# EAGLE schematic EasyBMS_Panel (EAGLE 9.6.2)

## Sheet 1 of 2
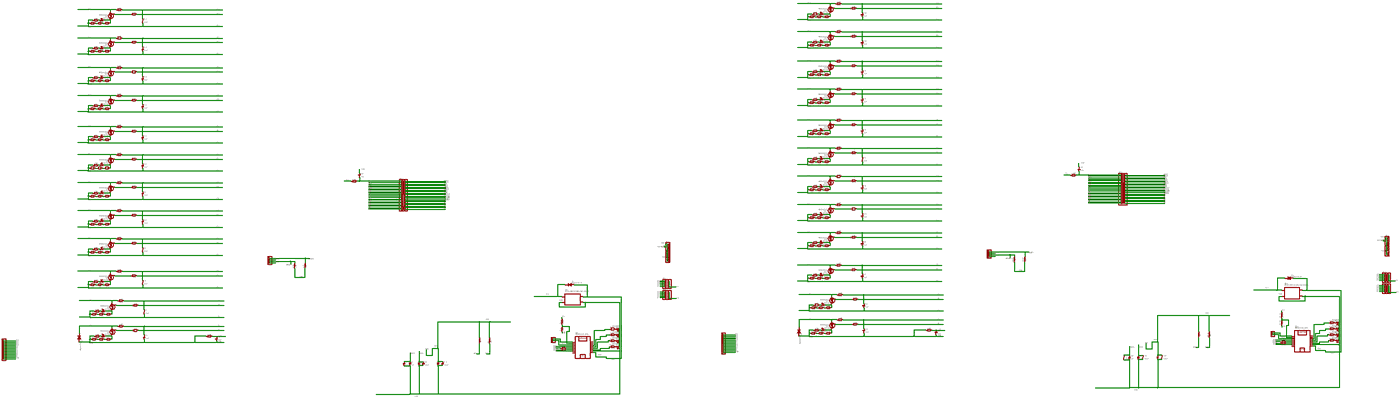
[diagram p0: schematic, sheet 1, overview]
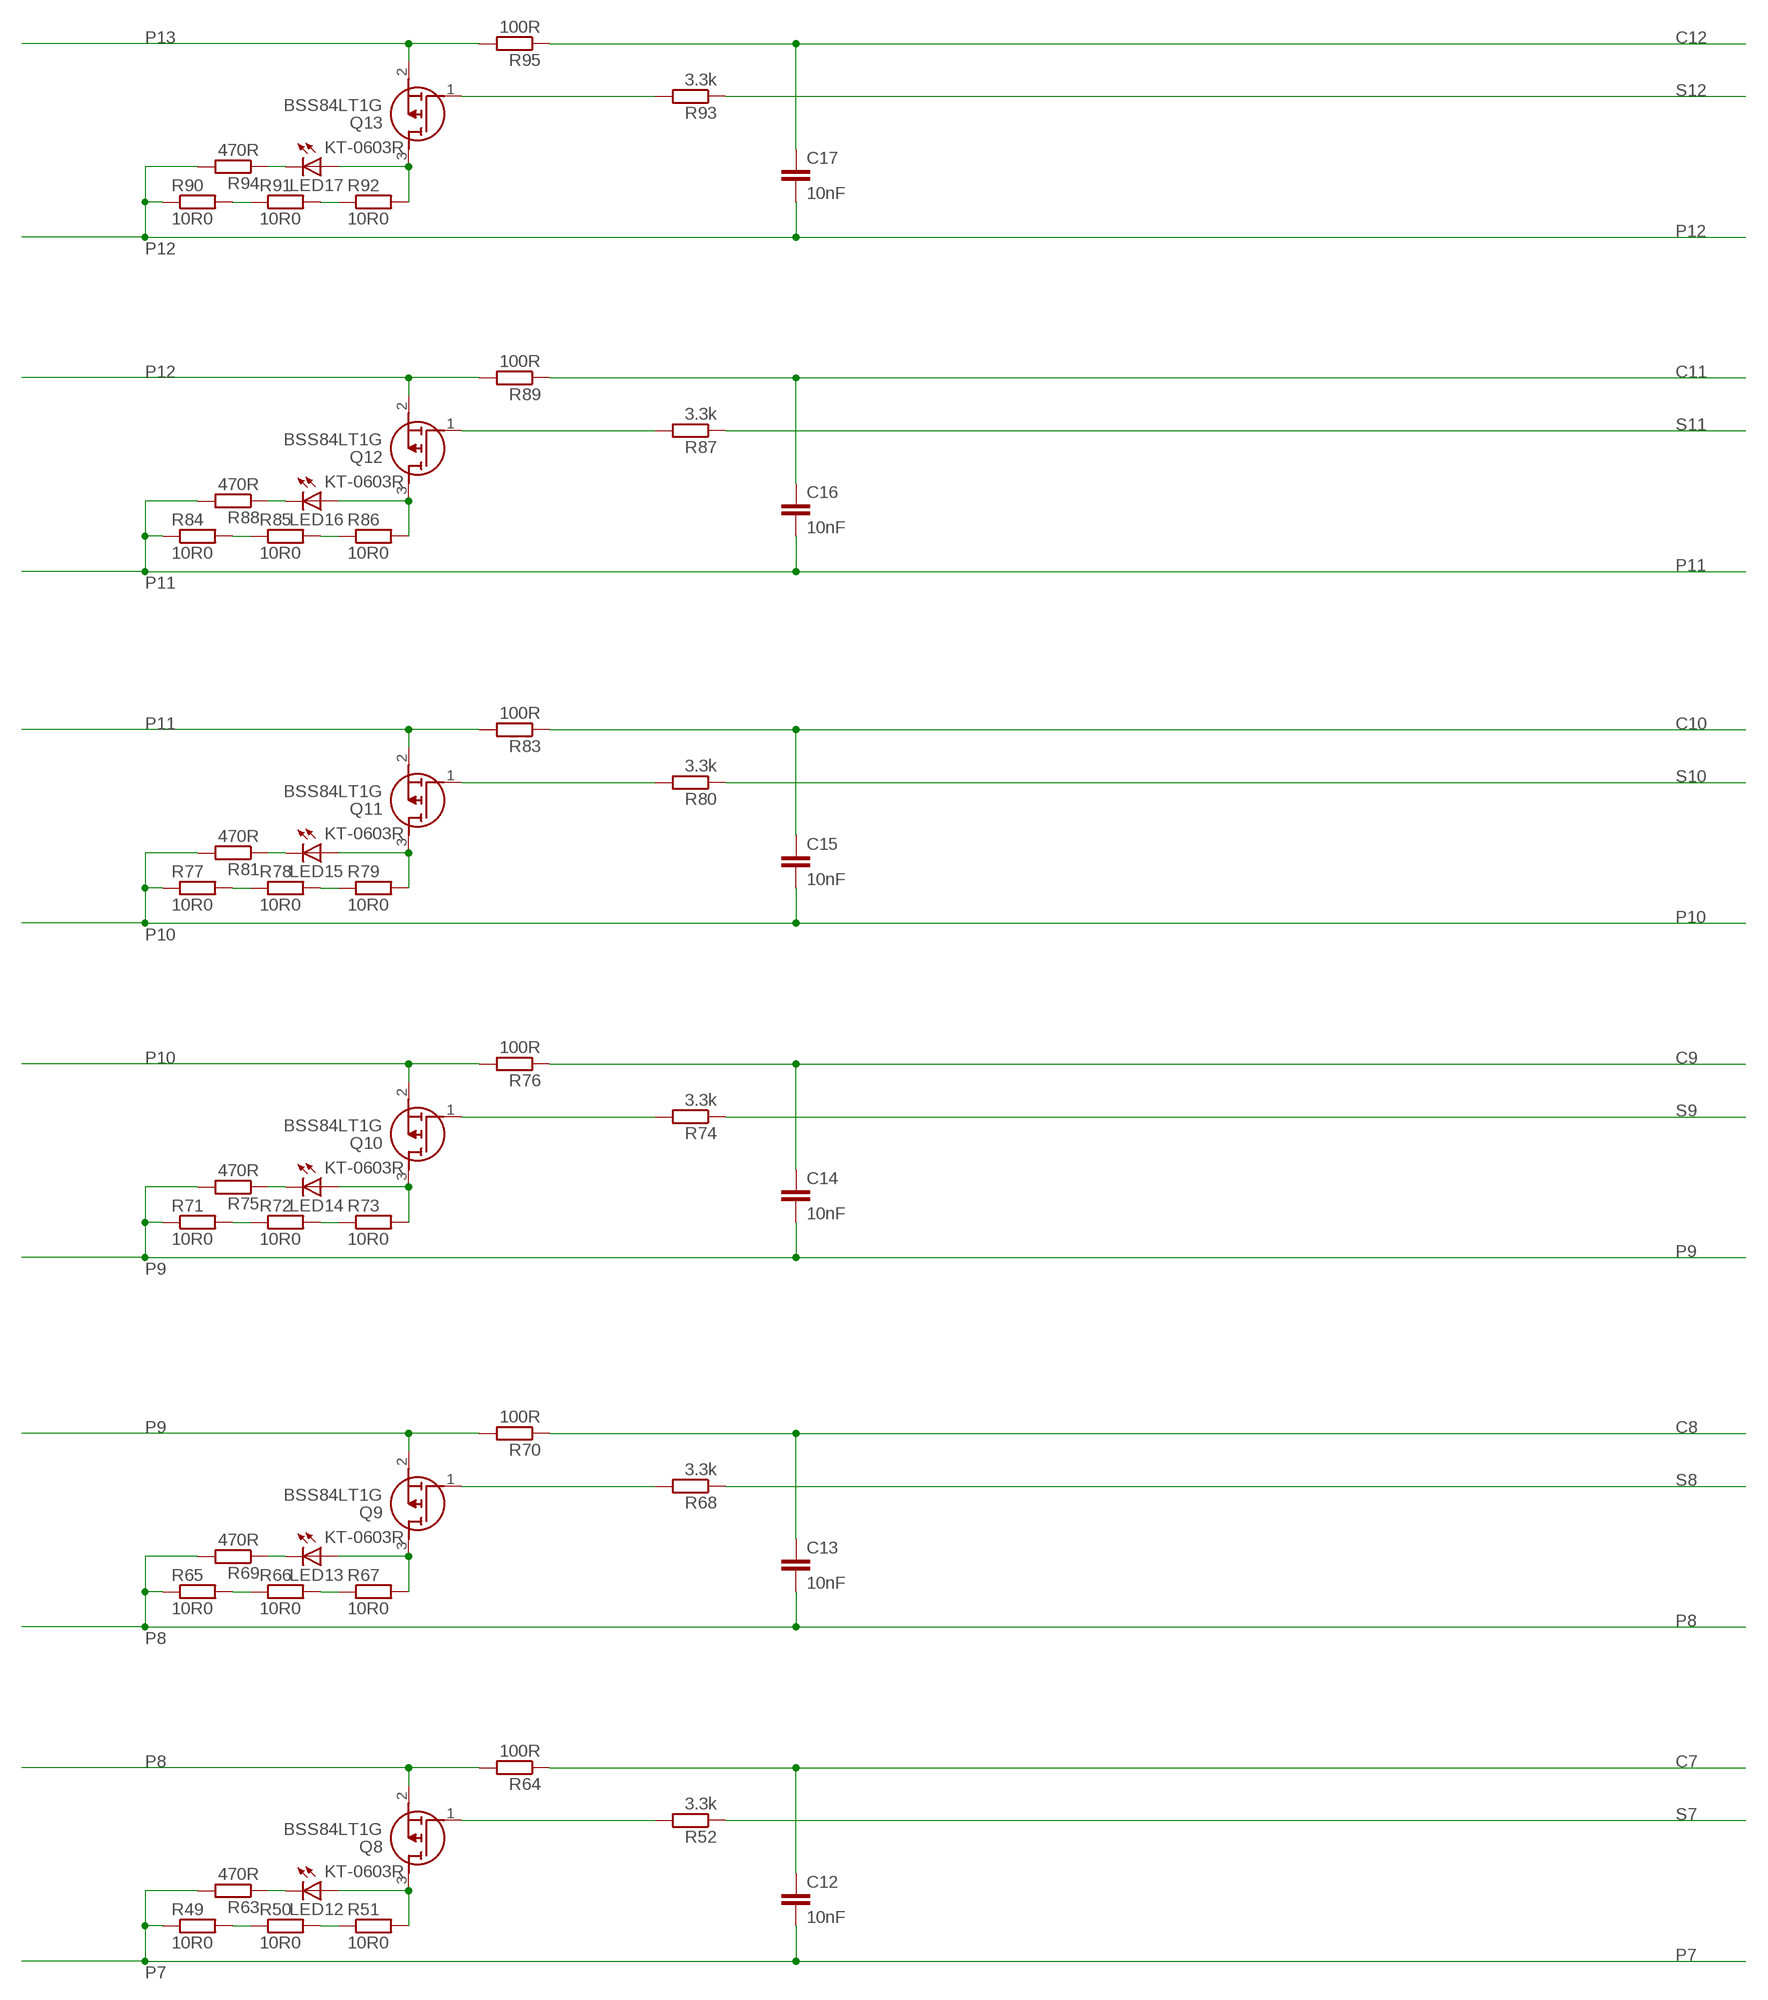
[diagram p1: schematic, sheet 1, part 1 of 8]
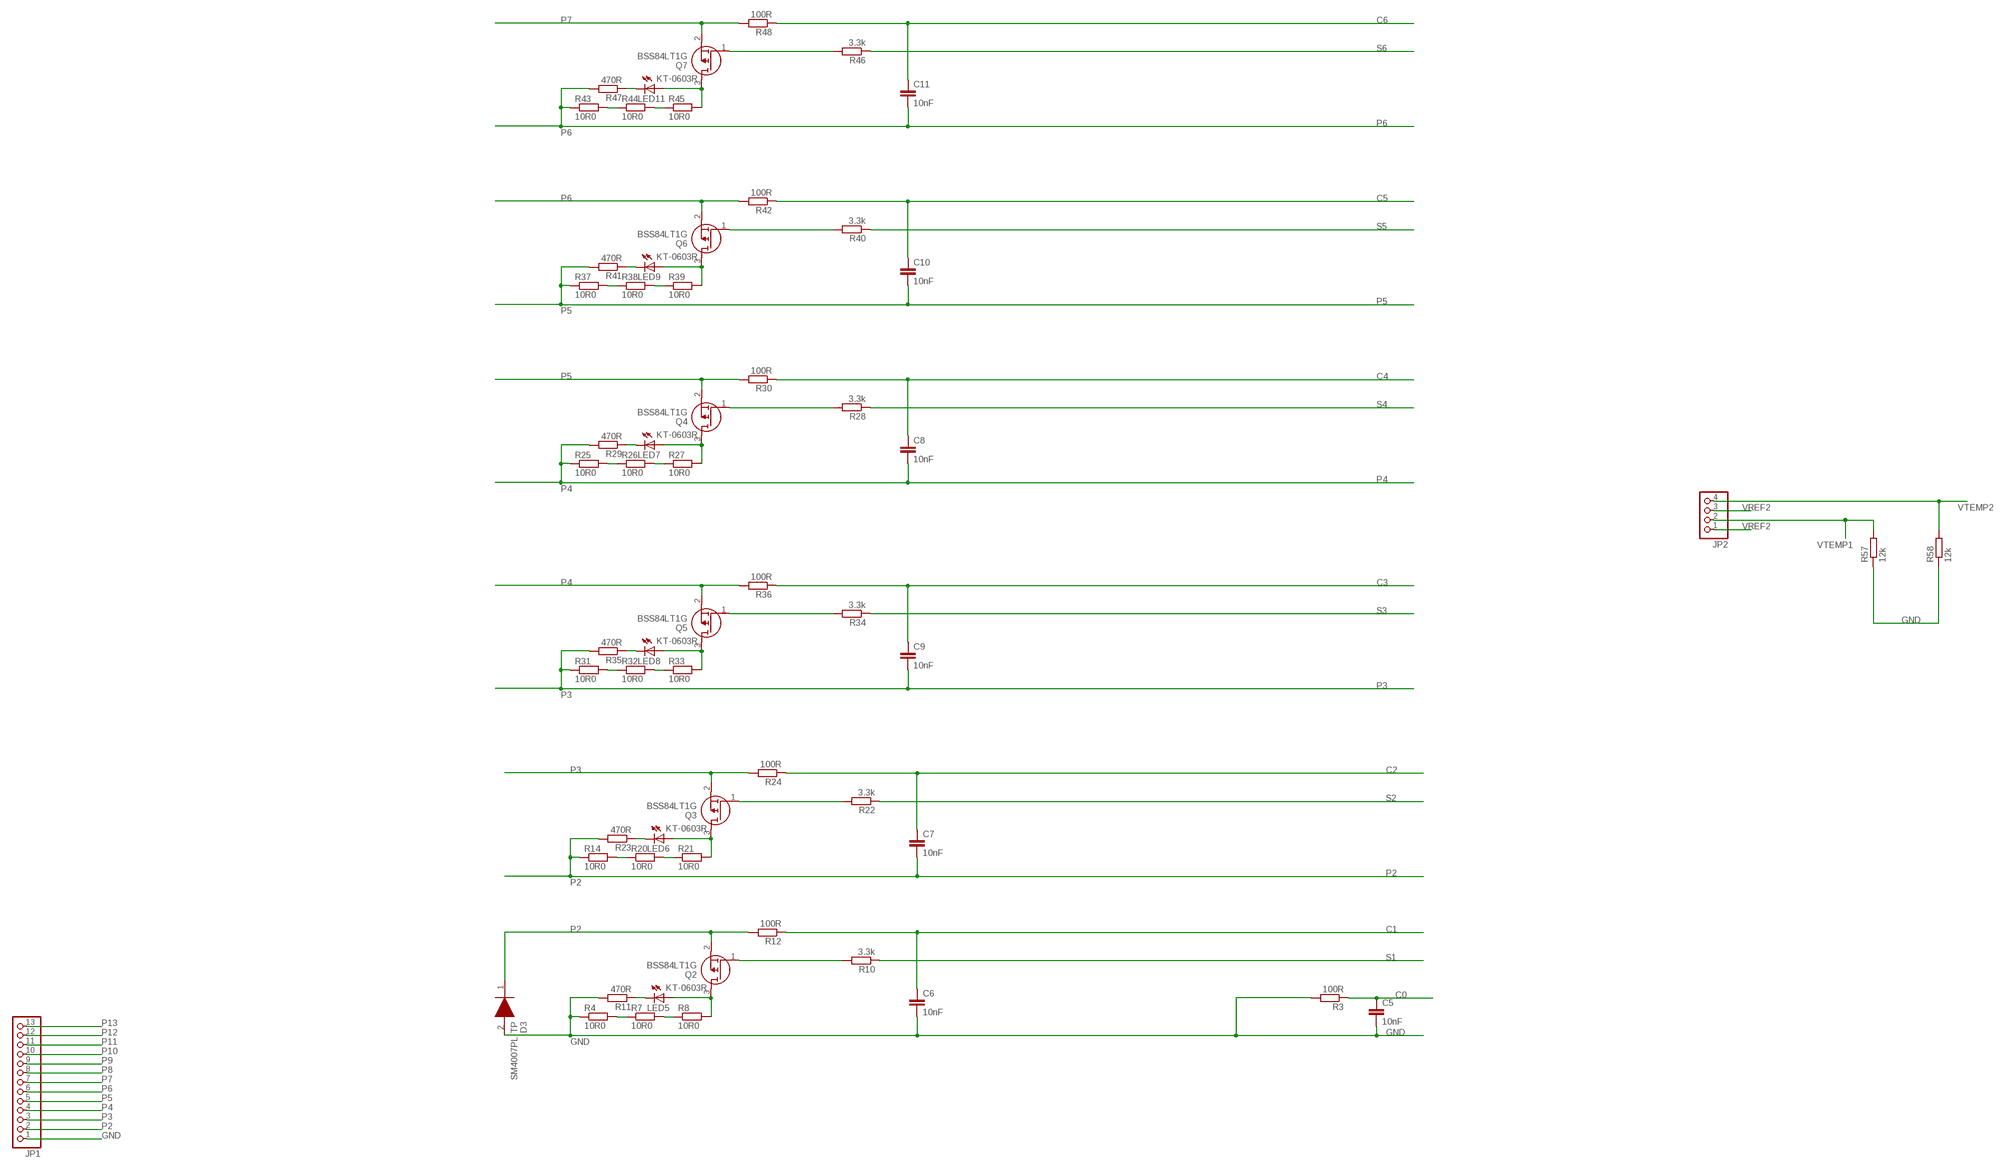
[diagram p2: schematic, sheet 1, part 2 of 8]
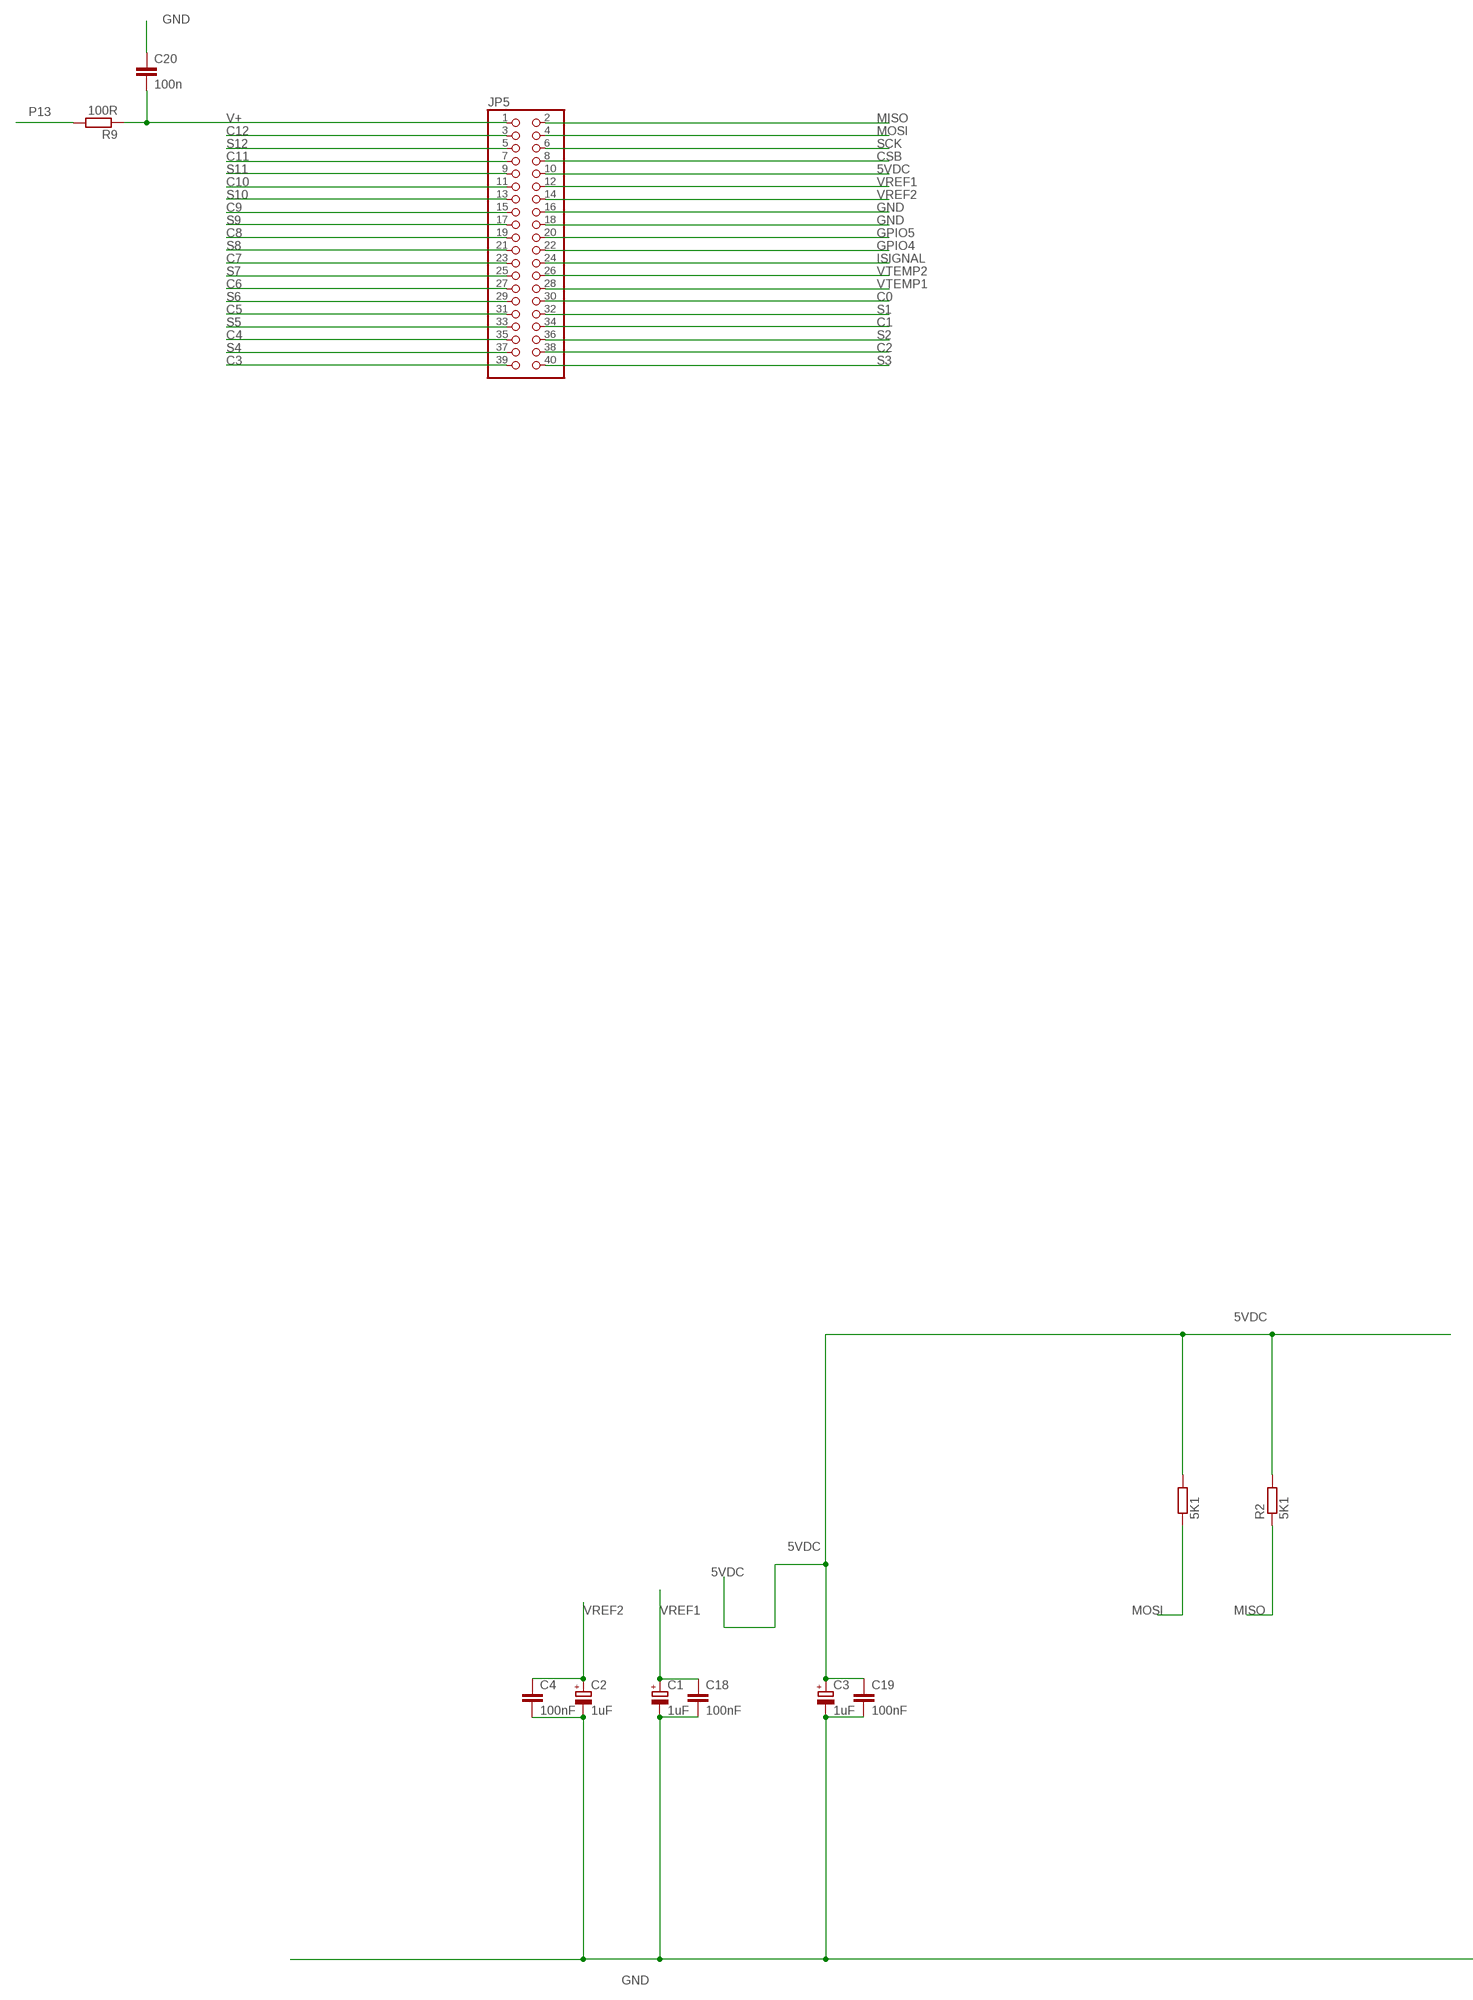
[diagram p3: schematic, sheet 1, part 3 of 8]
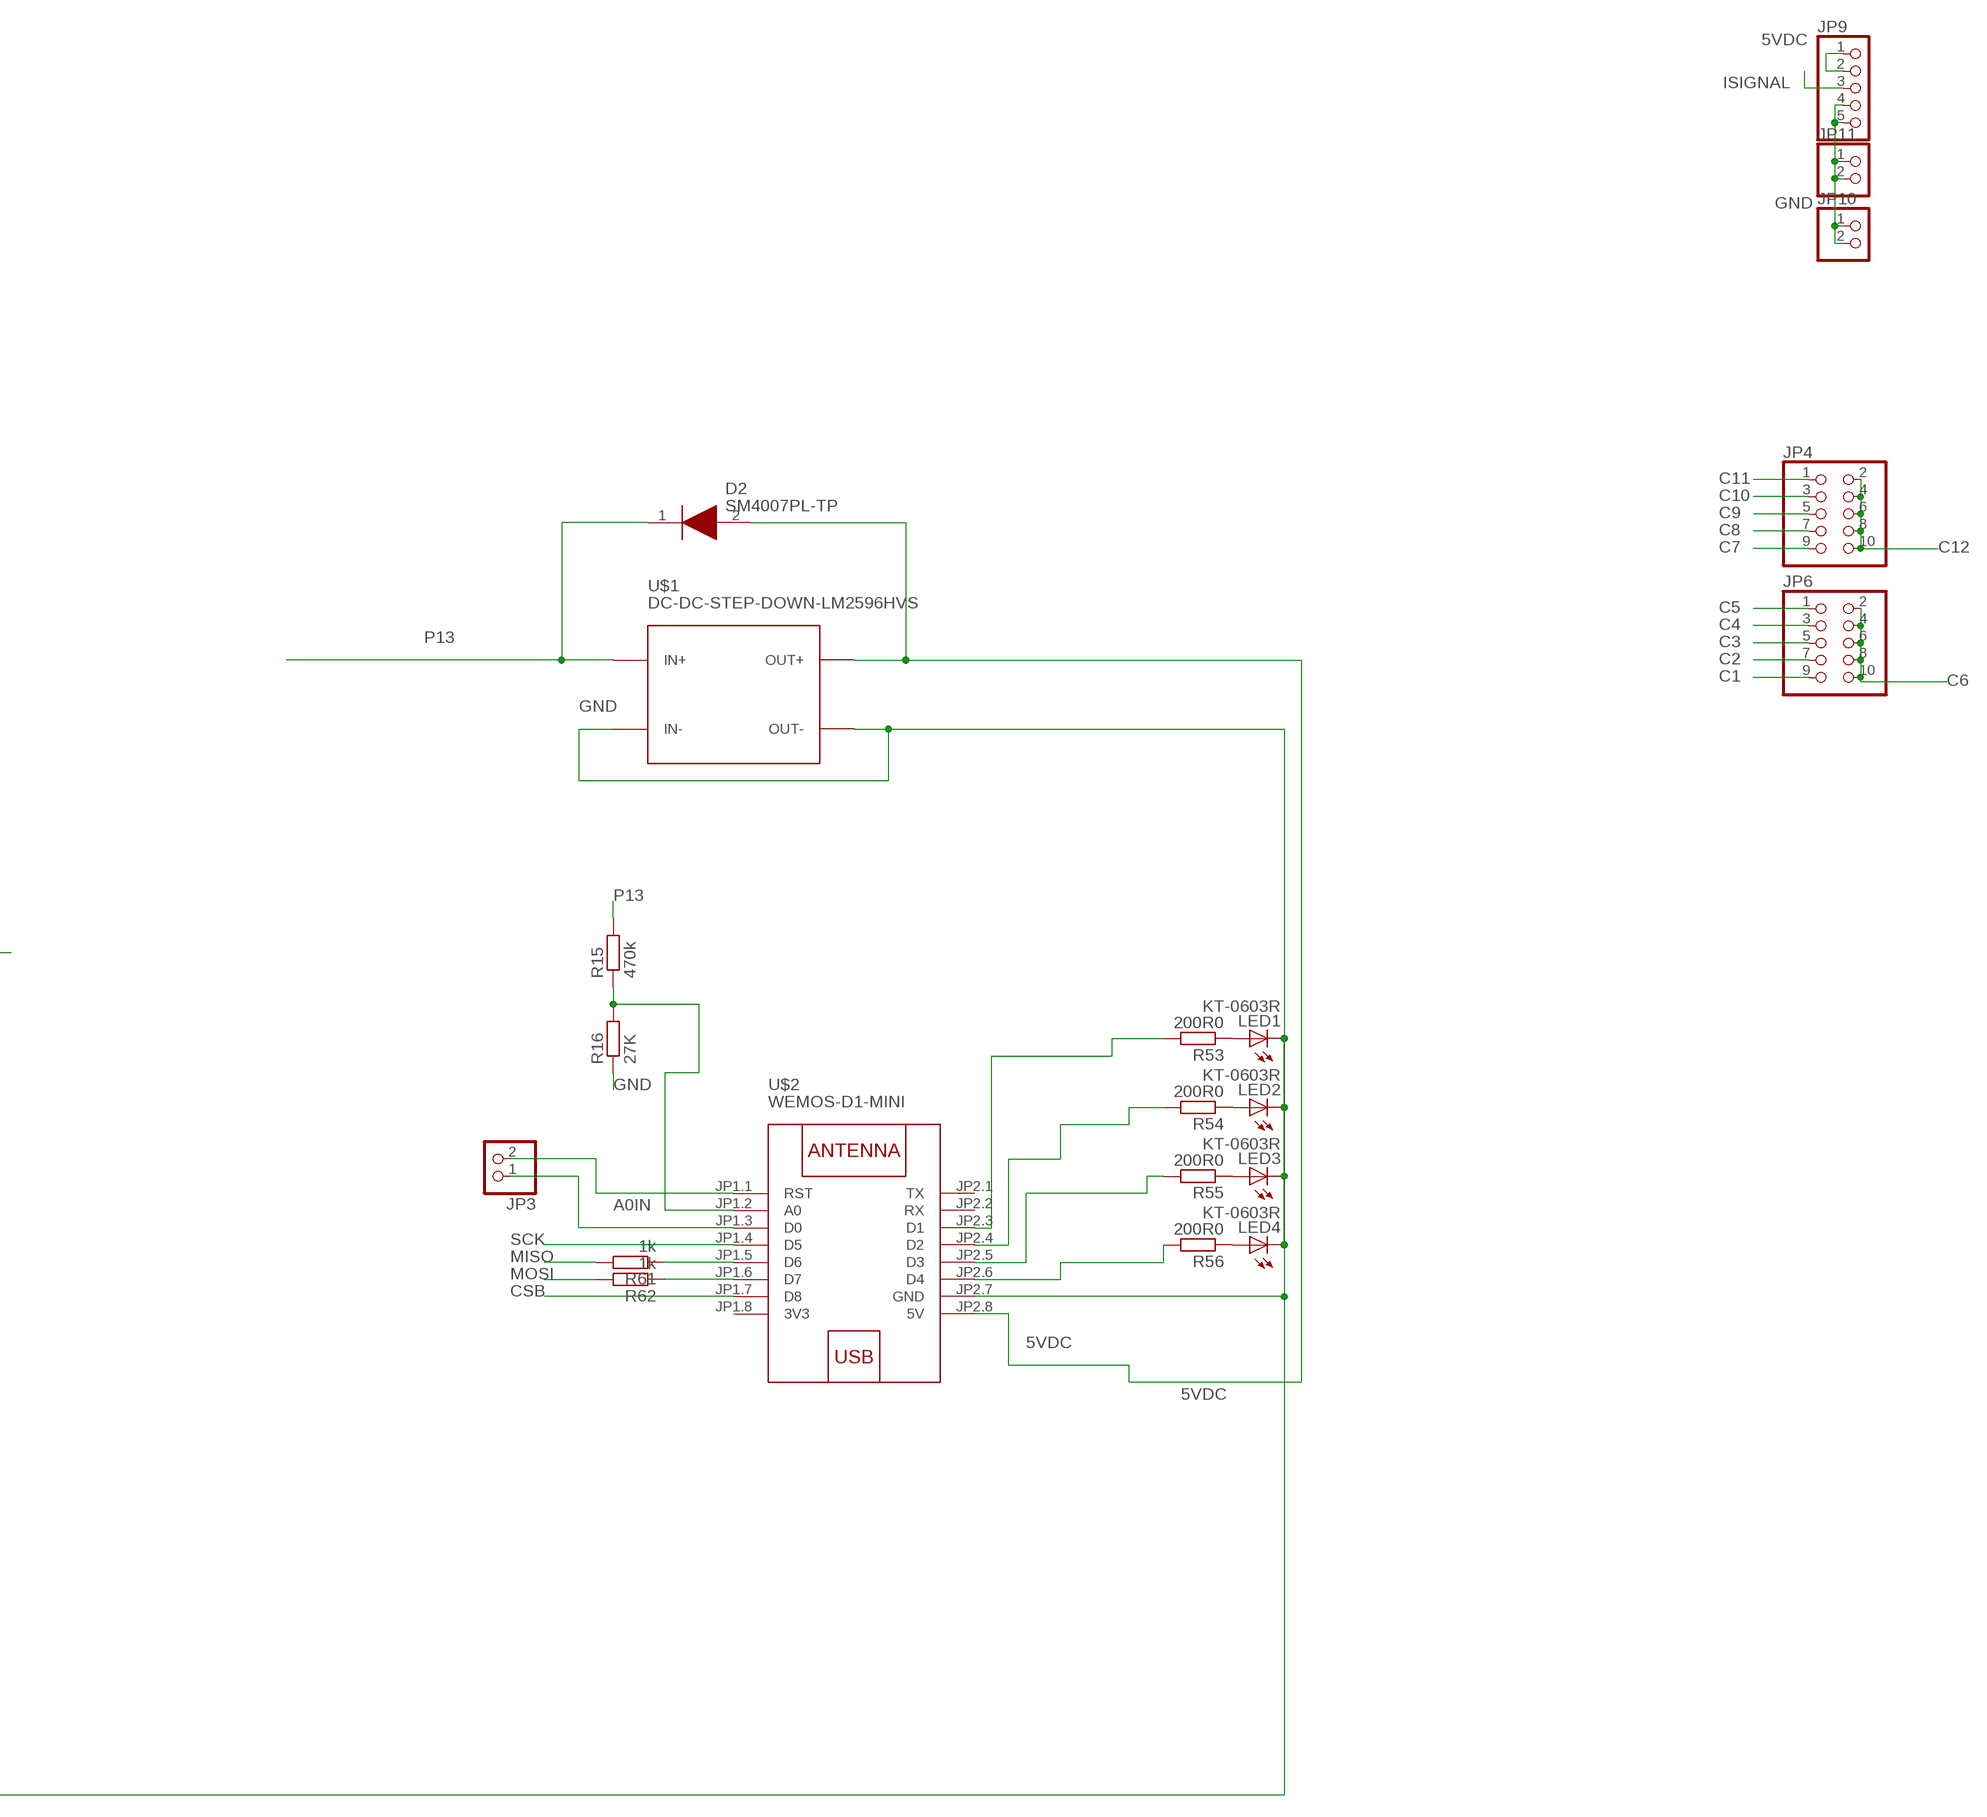
[diagram p4: schematic, sheet 1, part 4 of 8]
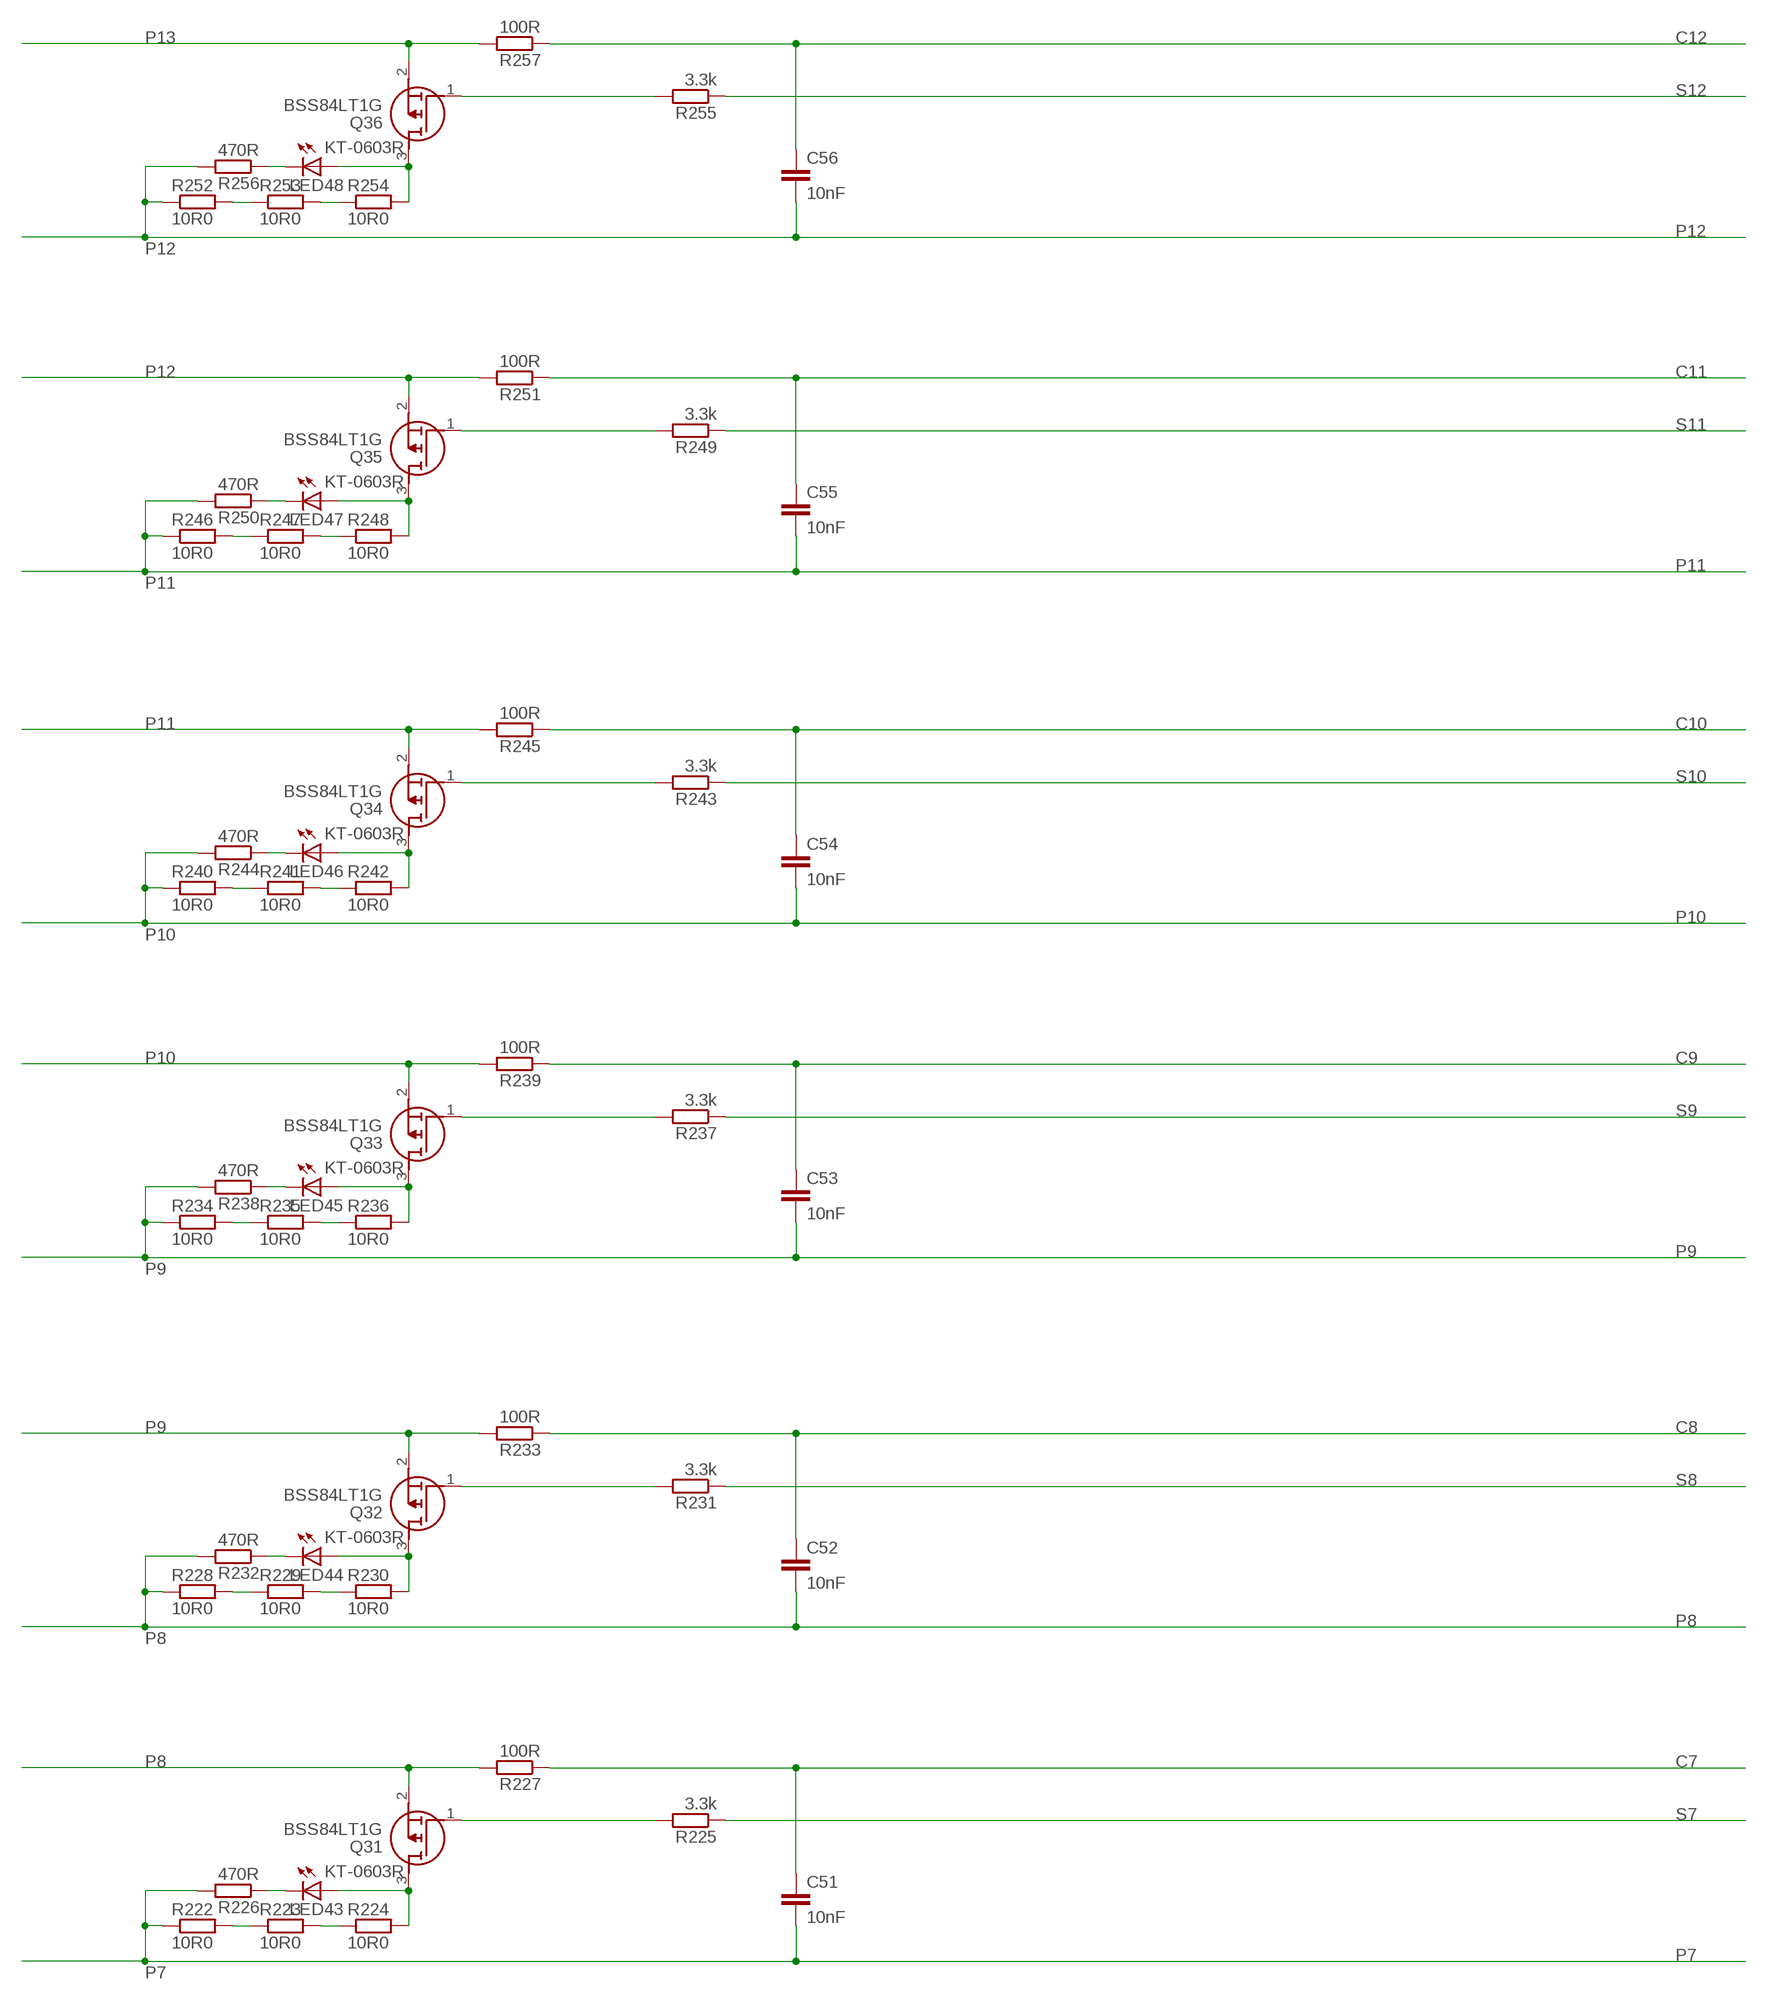
[diagram p5: schematic, sheet 1, part 5 of 8]
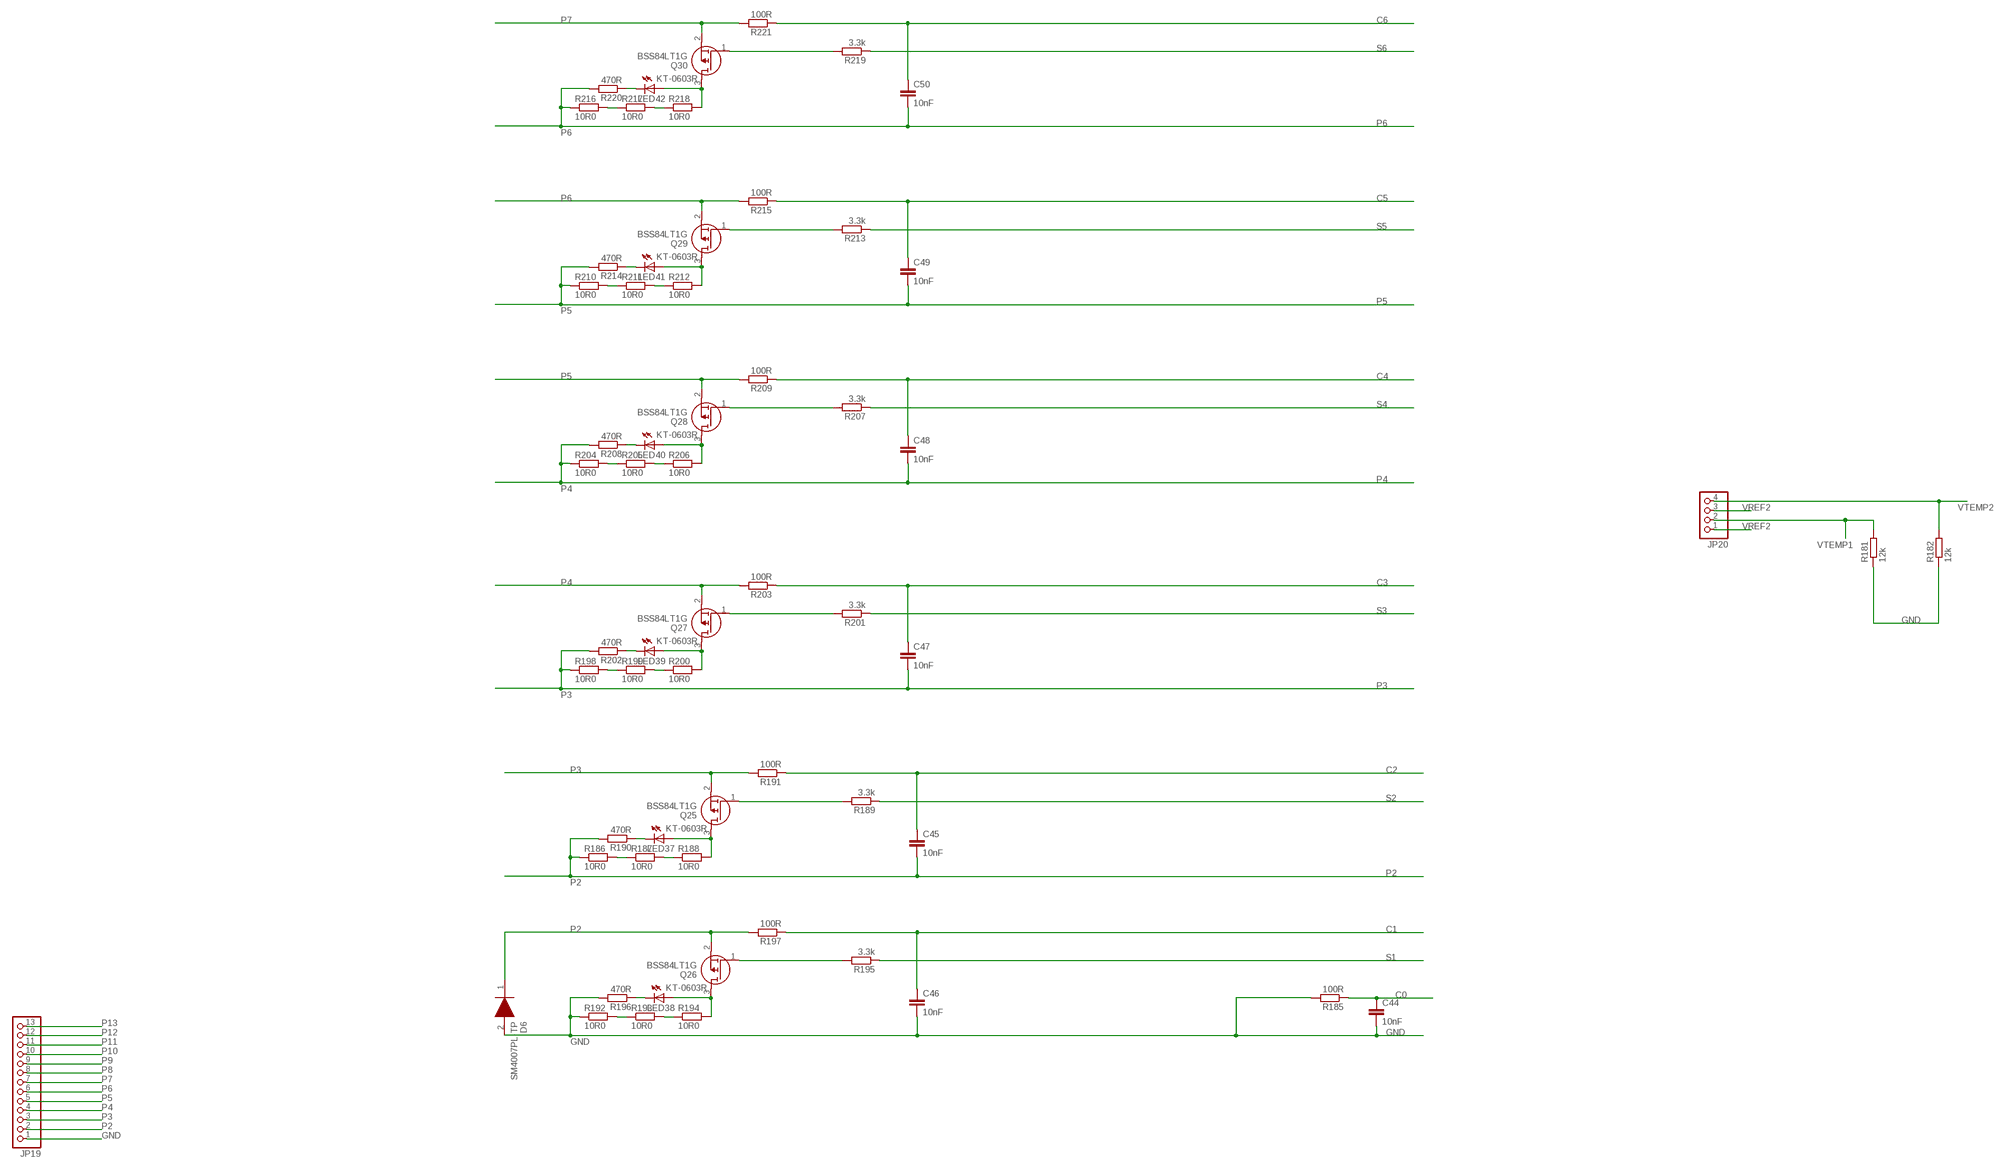
[diagram p6: schematic, sheet 1, part 6 of 8]
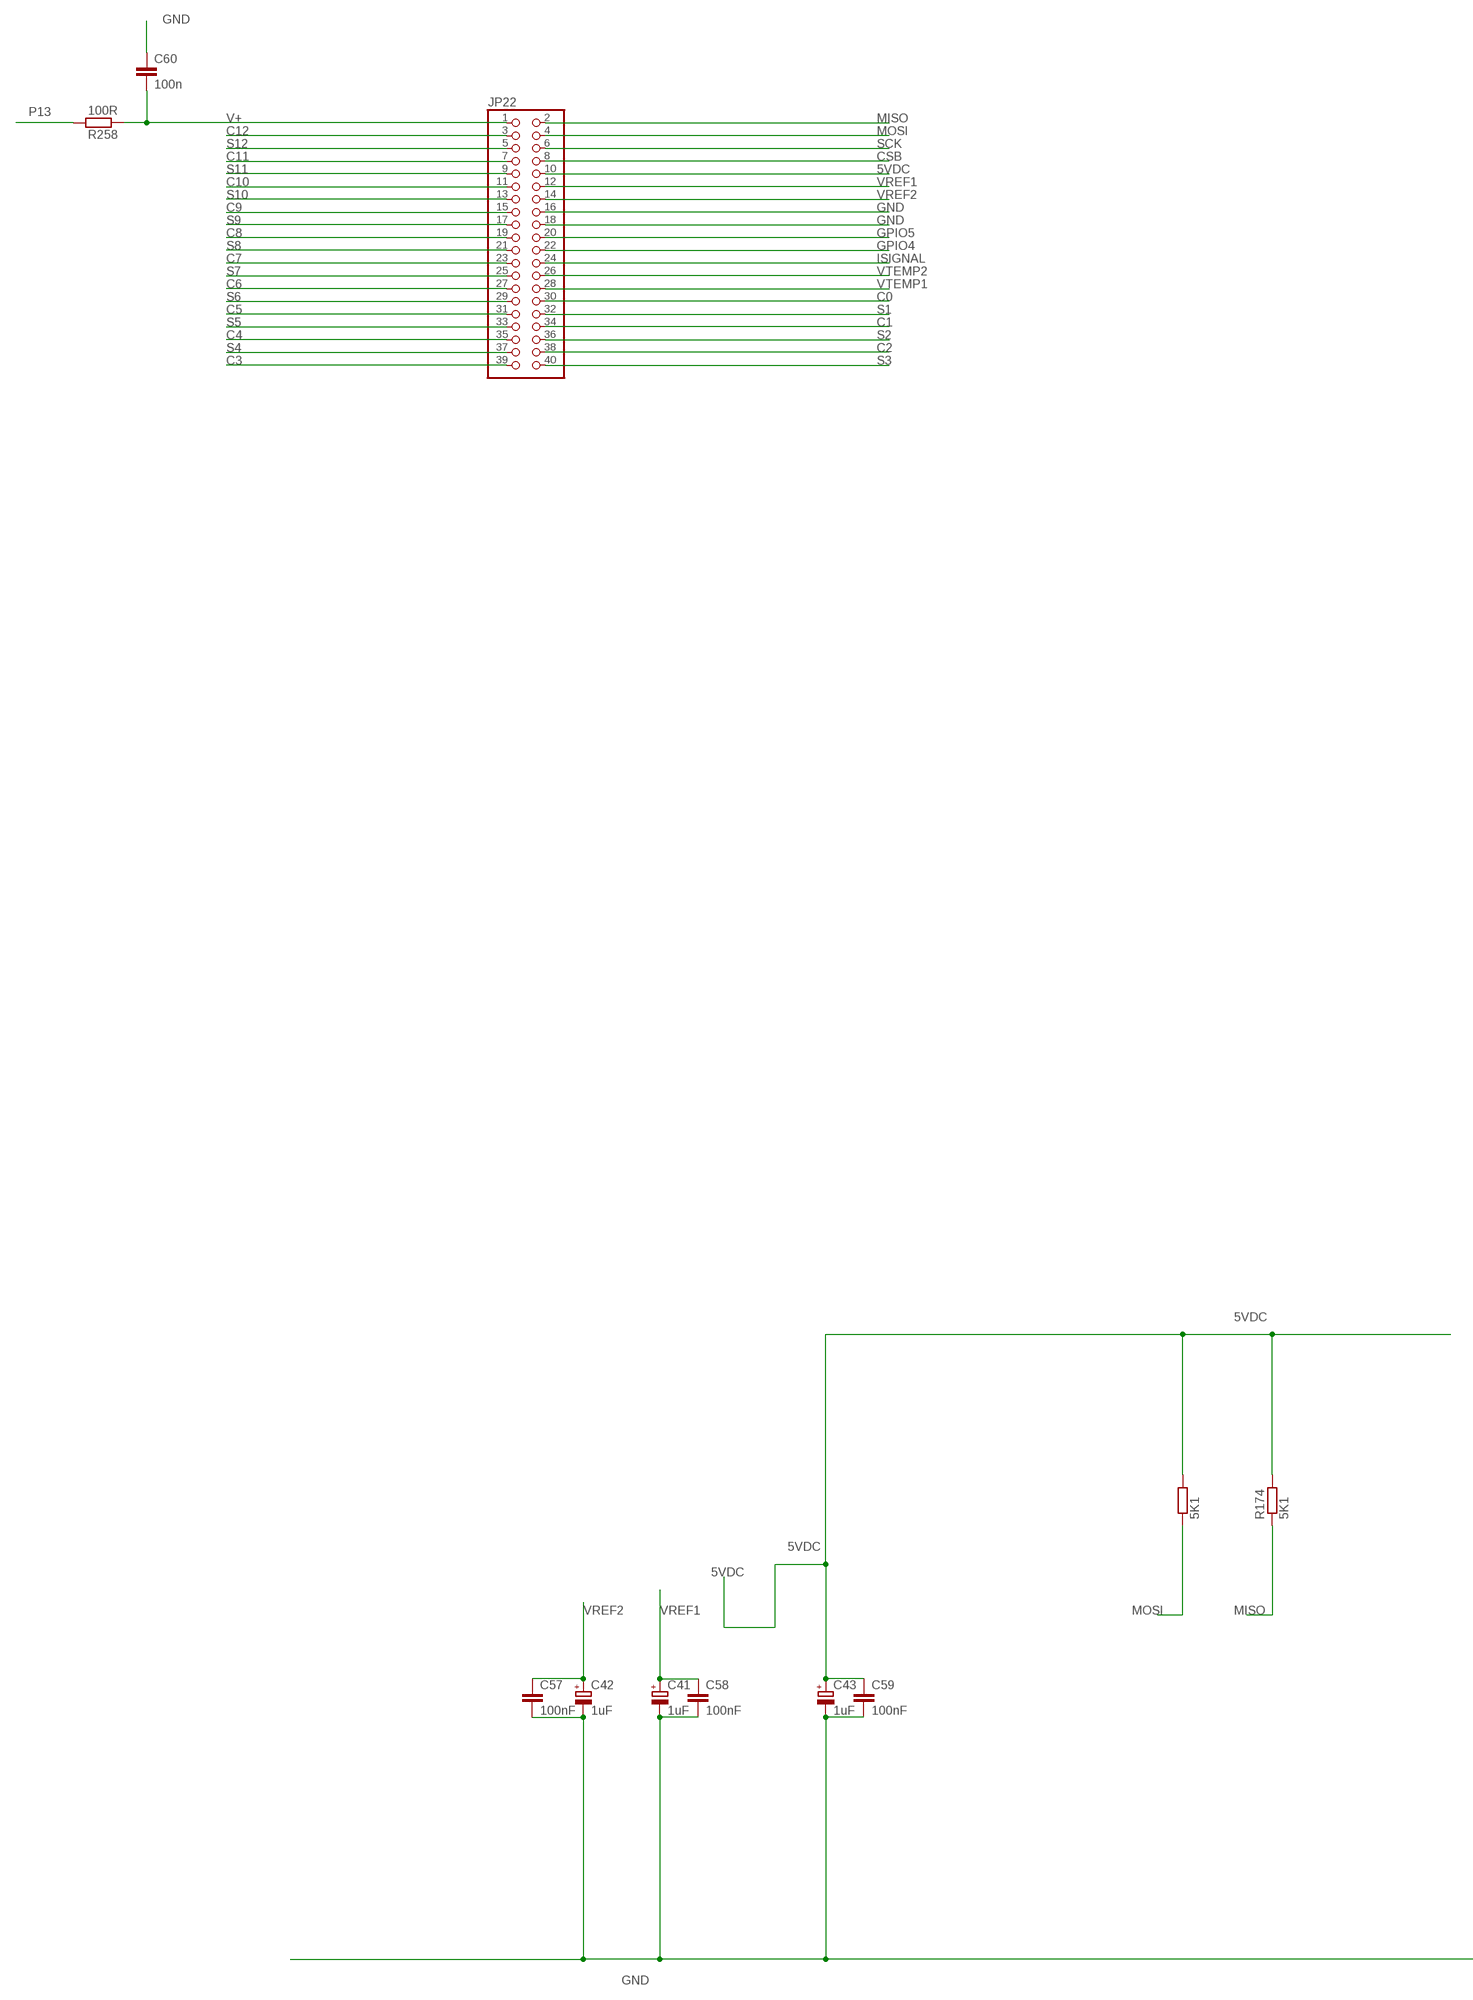
[diagram p7: schematic, sheet 1, part 7 of 8]
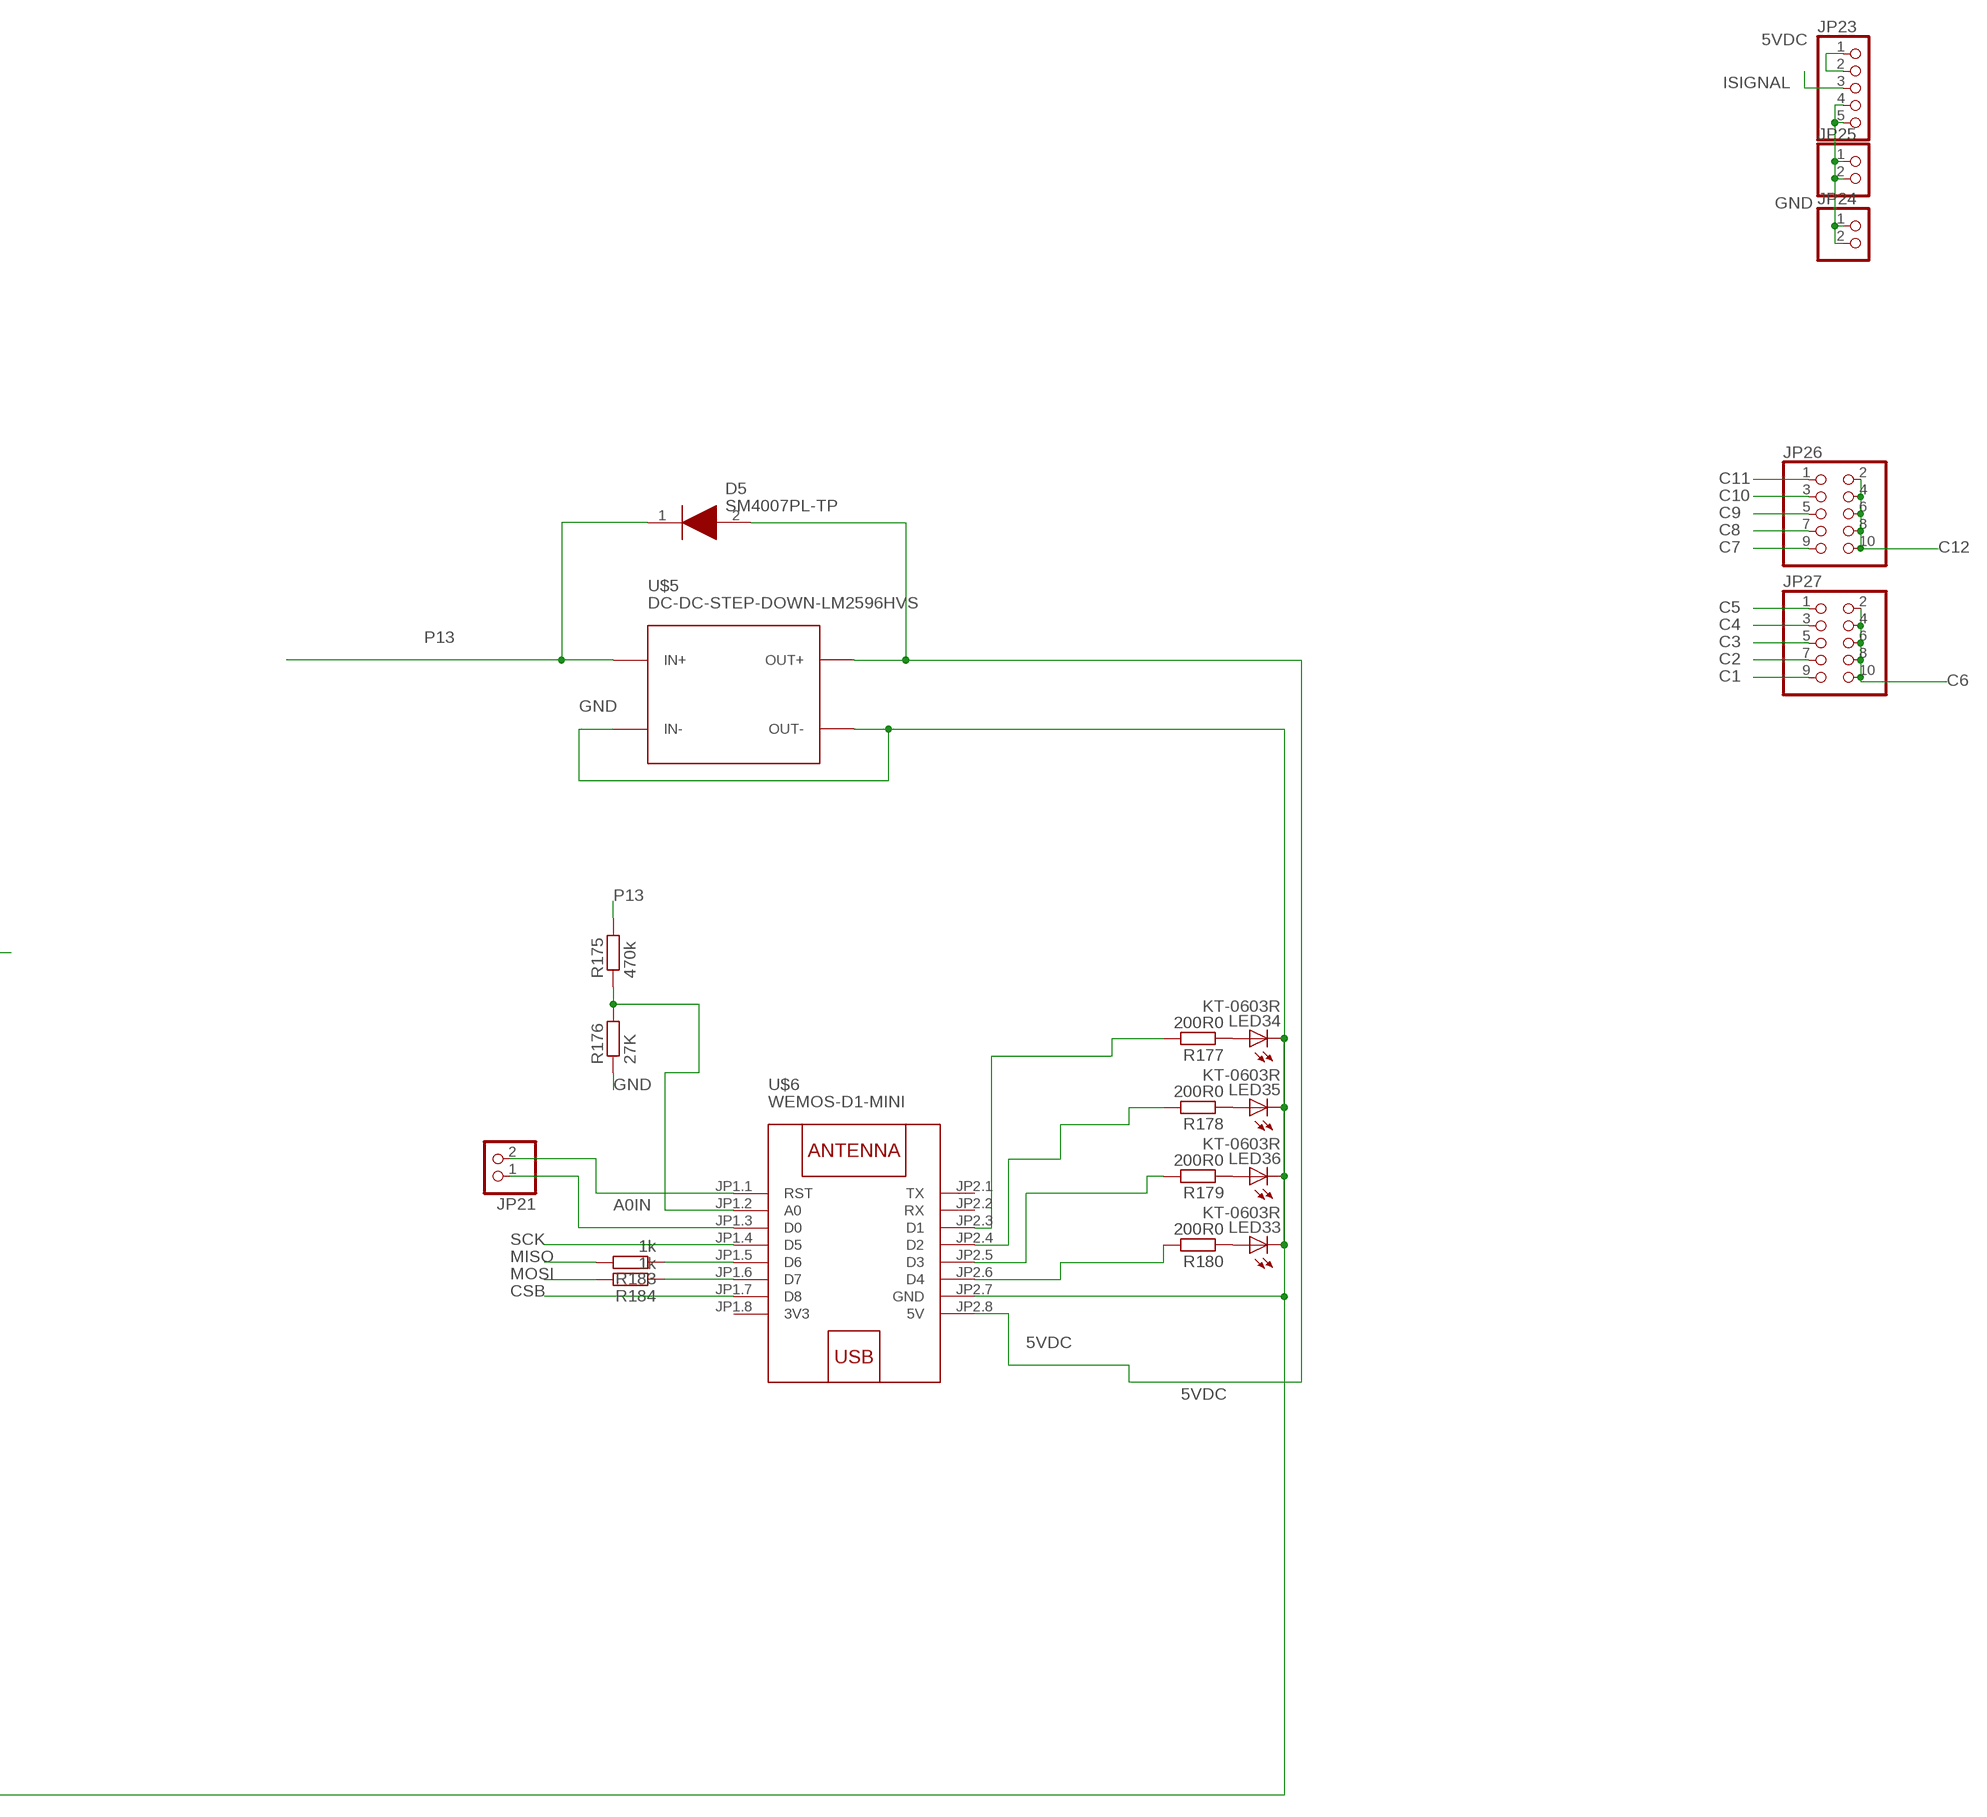
[diagram p8: schematic, sheet 1, part 8 of 8]

### Parts
C1  1uF  CPOL-EUE2.5-6  [E2,5-6]
C2  1uF  CPOL-EUE2.5-6  [E2,5-6]
C3  1uF  CPOL-EUE2.5-6  [E2,5-6]
C4  100nF  C-EUC1206  [C1206]
C5  10nF  C-EUC0402  [C0402]
C6  10nF  C-EUC0402  [C0402]
C7  10nF  C-EUC0402  [C0402]
C8  10nF  C-EUC0402  [C0402]
C9  10nF  C-EUC0402  [C0402]
C10  10nF  C-EUC0402  [C0402]
C11  10nF  C-EUC0402  [C0402]
C12  10nF  C-EUC0402  [C0402]
C13  10nF  C-EUC0402  [C0402]
C14  10nF  C-EUC0402  [C0402]
C15  10nF  C-EUC0402  [C0402]
C16  10nF  C-EUC0402  [C0402]
C17  10nF  C-EUC0402  [C0402]
C18  100nF  C-EUC1206  [C1206]
C19  100nF  C-EUC1206  [C1206]
C20  100n  C-EUC0402  [C0402]
C41  1uF  CPOL-EUE2.5-6  [E2,5-6]
C42  1uF  CPOL-EUE2.5-6  [E2,5-6]
C43  1uF  CPOL-EUE2.5-6  [E2,5-6]
C44  10nF  C-EUC0402  [C0402]
C45  10nF  C-EUC0402  [C0402]
C46  10nF  C-EUC0402  [C0402]
C47  10nF  C-EUC0402  [C0402]
C48  10nF  C-EUC0402  [C0402]
C49  10nF  C-EUC0402  [C0402]
C50  10nF  C-EUC0402  [C0402]
C51  10nF  C-EUC0402  [C0402]
C52  10nF  C-EUC0402  [C0402]
C53  10nF  C-EUC0402  [C0402]
C54  10nF  C-EUC0402  [C0402]
C55  10nF  C-EUC0402  [C0402]
C56  10nF  C-EUC0402  [C0402]
C57  100nF  C-EUC1206  [C1206]
C58  100nF  C-EUC1206  [C1206]
C59  100nF  C-EUC1206  [C1206]
C60  100n  C-EUC0402  [C0402]
D2  SM4007PL-TP  [SODFL3616X135N]
D3  SM4007PL-TP  [SODFL3616X135N]
D5  SM4007PL-TP  [SODFL3616X135N]
D6  SM4007PL-TP  [SODFL3616X135N]
JP1  PINHD-1X13/90  [1X13/90]
JP2  PINHD-1X4/90  [1X04/90]
JP3  PINHD-1X2  [1X02]
JP4  PINHD-2X5  [2X05]
JP5  PINHD-2X20  [2X20]
JP6  PINHD-2X5  [2X05]
JP9  PINHD-1X5  [1X05]
JP10  PINHD-1X2  [1X02]
JP11  PINHD-1X2  [1X02]
JP19  PINHD-1X13/90  [1X13/90]
JP20  PINHD-1X4/90  [1X04/90]
JP21  PINHD-1X2  [1X02]
JP22  PINHD-2X20  [2X20]
JP23  PINHD-1X5  [1X05]
JP24  PINHD-1X2  [1X02]
JP25  PINHD-1X2  [1X02]
JP26  PINHD-2X5  [2X05]
JP27  PINHD-2X5  [2X05]
LED1  KT-0603R  LEDCHIPLED_0603  [CHIPLED_0603]
LED2  KT-0603R  LEDCHIPLED_0603  [CHIPLED_0603]
LED3  KT-0603R  LEDCHIPLED_0603  [CHIPLED_0603]
LED4  KT-0603R  LEDCHIPLED_0603  [CHIPLED_0603]
LED5  KT-0603R  LEDCHIPLED_0603  [CHIPLED_0603]
LED6  KT-0603R  LEDCHIPLED_0603  [CHIPLED_0603]
LED7  KT-0603R  LEDCHIPLED_0603  [CHIPLED_0603]
LED8  KT-0603R  LEDCHIPLED_0603  [CHIPLED_0603]
LED9  KT-0603R  LEDCHIPLED_0603  [CHIPLED_0603]
LED11  KT-0603R  LEDCHIPLED_0603  [CHIPLED_0603]
LED12  KT-0603R  LEDCHIPLED_0603  [CHIPLED_0603]
LED13  KT-0603R  LEDCHIPLED_0603  [CHIPLED_0603]
LED14  KT-0603R  LEDCHIPLED_0603  [CHIPLED_0603]
LED15  KT-0603R  LEDCHIPLED_0603  [CHIPLED_0603]
LED16  KT-0603R  LEDCHIPLED_0603  [CHIPLED_0603]
LED17  KT-0603R  LEDCHIPLED_0603  [CHIPLED_0603]
LED33  KT-0603R  LEDCHIPLED_0603  [CHIPLED_0603]
LED34  KT-0603R  LEDCHIPLED_0603  [CHIPLED_0603]
LED35  KT-0603R  LEDCHIPLED_0603  [CHIPLED_0603]
LED36  KT-0603R  LEDCHIPLED_0603  [CHIPLED_0603]
LED37  KT-0603R  LEDCHIPLED_0603  [CHIPLED_0603]
LED38  KT-0603R  LEDCHIPLED_0603  [CHIPLED_0603]
LED39  KT-0603R  LEDCHIPLED_0603  [CHIPLED_0603]
LED40  KT-0603R  LEDCHIPLED_0603  [CHIPLED_0603]
LED41  KT-0603R  LEDCHIPLED_0603  [CHIPLED_0603]
LED42  KT-0603R  LEDCHIPLED_0603  [CHIPLED_0603]
LED43  KT-0603R  LEDCHIPLED_0603  [CHIPLED_0603]
LED44  KT-0603R  LEDCHIPLED_0603  [CHIPLED_0603]
LED45  KT-0603R  LEDCHIPLED_0603  [CHIPLED_0603]
LED46  KT-0603R  LEDCHIPLED_0603  [CHIPLED_0603]
LED47  KT-0603R  LEDCHIPLED_0603  [CHIPLED_0603]
LED48  KT-0603R  LEDCHIPLED_0603  [CHIPLED_0603]
Q2  BSS84LT1G  [SOT96P237X111-3N]
Q3  BSS84LT1G  [SOT96P237X111-3N]
Q4  BSS84LT1G  [SOT96P237X111-3N]
Q5  BSS84LT1G  [SOT96P237X111-3N]
Q6  BSS84LT1G  [SOT96P237X111-3N]
Q7  BSS84LT1G  [SOT96P237X111-3N]
Q8  BSS84LT1G  [SOT96P237X111-3N]
Q9  BSS84LT1G  [SOT96P237X111-3N]
Q10  BSS84LT1G  [SOT96P237X111-3N]
Q11  BSS84LT1G  [SOT96P237X111-3N]
Q12  BSS84LT1G  [SOT96P237X111-3N]
Q13  BSS84LT1G  [SOT96P237X111-3N]
Q25  BSS84LT1G  [SOT96P237X111-3N]
Q26  BSS84LT1G  [SOT96P237X111-3N]
Q27  BSS84LT1G  [SOT96P237X111-3N]
Q28  BSS84LT1G  [SOT96P237X111-3N]
Q29  BSS84LT1G  [SOT96P237X111-3N]
Q30  BSS84LT1G  [SOT96P237X111-3N]
Q31  BSS84LT1G  [SOT96P237X111-3N]
Q32  BSS84LT1G  [SOT96P237X111-3N]
Q33  BSS84LT1G  [SOT96P237X111-3N]
Q34  BSS84LT1G  [SOT96P237X111-3N]
Q35  BSS84LT1G  [SOT96P237X111-3N]
Q36  BSS84LT1G  [SOT96P237X111-3N]
R1  5K1  R-EU_R0603  [R0603]
R2  5K1  R-EU_R0603  [R0603]
R3  100R  R-EU_R0402  [R0402]
R4  10R0  R-EU_R1206  [R1206]
R7  10R0  R-EU_R1206  [R1206]
R8  10R0  R-EU_R1206  [R1206]
R9  100R  R-EU_R0402  [R0402]
R10  3.3k  R-EU_R0402  [R0402]
R11  470R  R-EU_R0402  [R0402]
R12  100R  R-EU_R0402  [R0402]
R14  10R0  R-EU_R1206  [R1206]
R15  470k  R-EU_R0603  [R0603]
R16  27K  R-EU_R0603  [R0603]
R20  10R0  R-EU_R1206  [R1206]
R21  10R0  R-EU_R1206  [R1206]
R22  3.3k  R-EU_R0402  [R0402]
R23  470R  R-EU_R0402  [R0402]
R24  100R  R-EU_R0402  [R0402]
R25  10R0  R-EU_R1206  [R1206]
R26  10R0  R-EU_R1206  [R1206]
R27  10R0  R-EU_R1206  [R1206]
R28  3.3k  R-EU_R0402  [R0402]
R29  470R  R-EU_R0402  [R0402]
R30  100R  R-EU_R0402  [R0402]
R31  10R0  R-EU_R1206  [R1206]
R32  10R0  R-EU_R1206  [R1206]
R33  10R0  R-EU_R1206  [R1206]
R34  3.3k  R-EU_R0402  [R0402]
R35  470R  R-EU_R0402  [R0402]
R36  100R  R-EU_R0402  [R0402]
R37  10R0  R-EU_R1206  [R1206]
R38  10R0  R-EU_R1206  [R1206]
R39  10R0  R-EU_R1206  [R1206]
R40  3.3k  R-EU_R0402  [R0402]
R41  470R  R-EU_R0402  [R0402]
R42  100R  R-EU_R0402  [R0402]
R43  10R0  R-EU_R1206  [R1206]
R44  10R0  R-EU_R1206  [R1206]
R45  10R0  R-EU_R1206  [R1206]
R46  3.3k  R-EU_R0402  [R0402]
R47  470R  R-EU_R0402  [R0402]
R48  100R  R-EU_R0402  [R0402]
R49  10R0  R-EU_R1206  [R1206]
R50  10R0  R-EU_R1206  [R1206]
R51  10R0  R-EU_R1206  [R1206]
R52  3.3k  R-EU_R0402  [R0402]
R53  200R0  R-EU_R0603  [R0603]
R54  200R0  R-EU_R0603  [R0603]
R55  200R0  R-EU_R0603  [R0603]
R56  200R0  R-EU_R0603  [R0603]
R57  12k  R-EU_R0603  [R0603]
R58  12k  R-EU_R0603  [R0603]
R61  1k  R-EU_R0603  [R0603]
R62  1k  R-EU_R0603  [R0603]
R63  470R  R-EU_R0402  [R0402]
R64  100R  R-EU_R0402  [R0402]
R65  10R0  R-EU_R1206  [R1206]
R66  10R0  R-EU_R1206  [R1206]
R67  10R0  R-EU_R1206  [R1206]
R68  3.3k  R-EU_R0402  [R0402]
R69  470R  R-EU_R0402  [R0402]
R70  100R  R-EU_R0402  [R0402]
R71  10R0  R-EU_R1206  [R1206]
R72  10R0  R-EU_R1206  [R1206]
R73  10R0  R-EU_R1206  [R1206]
R74  3.3k  R-EU_R0402  [R0402]
R75  470R  R-EU_R0402  [R0402]
R76  100R  R-EU_R0402  [R0402]
R77  10R0  R-EU_R1206  [R1206]
R78  10R0  R-EU_R1206  [R1206]
R79  10R0  R-EU_R1206  [R1206]
R80  3.3k  R-EU_R0402  [R0402]
R81  470R  R-EU_R0402  [R0402]
R83  100R  R-EU_R0402  [R0402]
R84  10R0  R-EU_R1206  [R1206]
R85  10R0  R-EU_R1206  [R1206]
R86  10R0  R-EU_R1206  [R1206]
R87  3.3k  R-EU_R0402  [R0402]
R88  470R  R-EU_R0402  [R0402]
R89  100R  R-EU_R0402  [R0402]
R90  10R0  R-EU_R1206  [R1206]
R91  10R0  R-EU_R1206  [R1206]
R92  10R0  R-EU_R1206  [R1206]
R93  3.3k  R-EU_R0402  [R0402]
R94  470R  R-EU_R0402  [R0402]
R95  100R  R-EU_R0402  [R0402]
R173  5K1  R-EU_R0603  [R0603]
R174  5K1  R-EU_R0603  [R0603]
R175  470k  R-EU_R0603  [R0603]
R176  27K  R-EU_R0603  [R0603]
R177  200R0  R-EU_R0603  [R0603]
R178  200R0  R-EU_R0603  [R0603]
R179  200R0  R-EU_R0603  [R0603]
R180  200R0  R-EU_R0603  [R0603]
R181  12k  R-EU_R0603  [R0603]
R182  12k  R-EU_R0603  [R0603]
R183  1k  R-EU_R0603  [R0603]
R184  1k  R-EU_R0603  [R0603]
R185  100R  R-EU_R0402  [R0402]
R186  10R0  R-EU_R1206  [R1206]
R187  10R0  R-EU_R1206  [R1206]
R188  10R0  R-EU_R1206  [R1206]
R189  3.3k  R-EU_R0402  [R0402]
R190  470R  R-EU_R0402  [R0402]
R191  100R  R-EU_R0402  [R0402]
R192  10R0  R-EU_R1206  [R1206]
R193  10R0  R-EU_R1206  [R1206]
R194  10R0  R-EU_R1206  [R1206]
R195  3.3k  R-EU_R0402  [R0402]
R196  470R  R-EU_R0402  [R0402]
R197  100R  R-EU_R0402  [R0402]
R198  10R0  R-EU_R1206  [R1206]
R199  10R0  R-EU_R1206  [R1206]
R200  10R0  R-EU_R1206  [R1206]
R201  3.3k  R-EU_R0402  [R0402]
R202  470R  R-EU_R0402  [R0402]
R203  100R  R-EU_R0402  [R0402]
R204  10R0  R-EU_R1206  [R1206]
R205  10R0  R-EU_R1206  [R1206]
R206  10R0  R-EU_R1206  [R1206]
R207  3.3k  R-EU_R0402  [R0402]
R208  470R  R-EU_R0402  [R0402]
R209  100R  R-EU_R0402  [R0402]
R210  10R0  R-EU_R1206  [R1206]
R211  10R0  R-EU_R1206  [R1206]
R212  10R0  R-EU_R1206  [R1206]
R213  3.3k  R-EU_R0402  [R0402]
R214  470R  R-EU_R0402  [R0402]
R215  100R  R-EU_R0402  [R0402]
R216  10R0  R-EU_R1206  [R1206]
R217  10R0  R-EU_R1206  [R1206]
R218  10R0  R-EU_R1206  [R1206]
R219  3.3k  R-EU_R0402  [R0402]
R220  470R  R-EU_R0402  [R0402]
R221  100R  R-EU_R0402  [R0402]
R222  10R0  R-EU_R1206  [R1206]
R223  10R0  R-EU_R1206  [R1206]
R224  10R0  R-EU_R1206  [R1206]
R225  3.3k  R-EU_R0402  [R0402]
R226  470R  R-EU_R0402  [R0402]
R227  100R  R-EU_R0402  [R0402]
R228  10R0  R-EU_R1206  [R1206]
R229  10R0  R-EU_R1206  [R1206]
R230  10R0  R-EU_R1206  [R1206]
R231  3.3k  R-EU_R0402  [R0402]
R232  470R  R-EU_R0402  [R0402]
R233  100R  R-EU_R0402  [R0402]
R234  10R0  R-EU_R1206  [R1206]
R235  10R0  R-EU_R1206  [R1206]
R236  10R0  R-EU_R1206  [R1206]
R237  3.3k  R-EU_R0402  [R0402]
R238  470R  R-EU_R0402  [R0402]
R239  100R  R-EU_R0402  [R0402]
R240  10R0  R-EU_R1206  [R1206]
R241  10R0  R-EU_R1206  [R1206]
R242  10R0  R-EU_R1206  [R1206]
R243  3.3k  R-EU_R0402  [R0402]
R244  470R  R-EU_R0402  [R0402]
R245  100R  R-EU_R0402  [R0402]
R246  10R0  R-EU_R1206  [R1206]
R247  10R0  R-EU_R1206  [R1206]
R248  10R0  R-EU_R1206  [R1206]
R249  3.3k  R-EU_R0402  [R0402]
R250  470R  R-EU_R0402  [R0402]
R251  100R  R-EU_R0402  [R0402]
R252  10R0  R-EU_R1206  [R1206]
R253  10R0  R-EU_R1206  [R1206]
R254  10R0  R-EU_R1206  [R1206]
R255  3.3k  R-EU_R0402  [R0402]
R256  470R  R-EU_R0402  [R0402]
R257  100R  R-EU_R0402  [R0402]
R258  100R  R-EU_R0402  [R0402]
U$1  DC-DC-STEP-DOWN-LM2596HVS  [DC-DC-STEP-DOWN-LM2596HVS]
U$2  WEMOS-D1-MINI  [WEMOS-D1-MINI]
U$5  DC-DC-STEP-DOWN-LM2596HVS  [DC-DC-STEP-DOWN-LM2596HVS]
U$6  WEMOS-D1-MINI  [WEMOS-D1-MINI]

### Nets
5VDC: C3.+ C19.1 C43.+ C59.1 D2.2(A) D5.2(A) JP5.10 JP9.1 JP9.2 JP22.10 JP23.1 JP23.2 R1.2 R2.2 R173.2 R174.2 U$1.OUT+ U$2.JP2.8(5V) U$5.OUT+ U$6.JP2.8(5V)
A0IN: R15.1 R16.2 R175.1 R176.2 U$2.JP1.2(A0) U$6.JP1.2(A0)
C0: C5.1 C44.1 JP5.30 JP22.30 R3.1 R185.1
C1: C6.1 C46.1 JP5.34 JP6.9 JP22.34 JP27.9 R12.1 R197.1
C2: C7.1 C45.1 JP5.38 JP6.7 JP22.38 JP27.7 R24.1 R191.1
C3: C9.1 C47.1 JP5.39 JP6.5 JP22.39 JP27.5 R36.1 R203.1
C4: C8.1 C48.1 JP5.35 JP6.3 JP22.35 JP27.3 R30.1 R209.1
C5: C10.1 C49.1 JP5.31 JP6.1 JP22.31 JP27.1 R42.1 R215.1
C6: C11.1 C50.1 JP5.27 JP6.2 JP6.4 JP6.6 JP6.8 JP6.10 JP22.27 JP27.2 JP27.4 JP27.6 JP27.8 JP27.10 R48.1 R221.1
C7: C12.1 C51.1 JP4.9 JP5.23 JP22.23 JP26.9 R64.1 R227.1
C8: C13.1 C52.1 JP4.7 JP5.19 JP22.19 JP26.7 R70.1 R233.1
C9: C14.1 C53.1 JP4.5 JP5.15 JP22.15 JP26.5 R76.1 R239.1
C10: C15.1 C54.1 JP4.3 JP5.11 JP22.11 JP26.3 R83.1 R245.1
C11: C16.1 C55.1 JP4.1 JP5.7 JP22.7 JP26.1 R89.1 R251.1
C12: C17.1 C56.1 JP4.2 JP4.4 JP4.6 JP4.8 JP4.10 JP5.3 JP22.3 JP26.2 JP26.4 JP26.6 JP26.8 JP26.10 R95.1 R257.1
CSB: JP5.8 JP22.8 U$2.JP1.7(D8) U$6.JP1.7(D8)
GND: C1.- C2.- C3.- C4.2 C5.2 C6.2 C18.2 C19.2 C20.1 C41.- C42.- C43.- C44.2 C46.2 C57.2 C58.2 C59.2 C60.1 D3.2(A) D6.2(A) JP1.1 JP5.16 JP5.18 JP9.4 JP9.5 JP10.1 JP10.2 JP11.1 JP11.2 JP19.1 JP22.16 JP22.18 JP23.4 JP23.5 JP24.1 JP24.2 JP25.1 JP25.2 LED1.C LED2.C LED3.C LED4.C LED33.C LED34.C LED35.C LED36.C R3.2 R4.1 R11.2 R16.1 R57.1 R58.1 R176.1 R181.1 R182.1 R185.2 R192.1 R196.2 U$1.IN- U$1.OUT- U$2.JP2.7(GND) U$5.IN- U$5.OUT- U$6.JP2.7(GND)
GPIO4: JP5.22 JP22.22
GPIO5: JP5.20 JP22.20
ISIGNAL: JP5.24 JP9.3 JP22.24 JP23.3
MISO: JP5.2 JP22.2 R2.1 R61.2 R174.1 R183.2
MOSI: JP5.4 JP22.4 R1.1 R62.2 R173.1 R184.2
N$1: LED1.A R53.1
N$2: LED2.A R54.1
N$3: LED3.A R55.1
N$4: LED4.A R56.1
N$5: JP3.2 U$2.JP1.1(RST)
N$6: JP3.1 U$2.JP1.3(D0)
N$8: R4.2 R7.1
N$9: R7.2 R8.1
N$10: LED5.A Q2.3(D) R8.2
N$11: Q2.1(G) R10.2
N$12: LED5.C R11.1
N$13: R14.2 R20.1
N$14: R20.2 R21.1
N$16: LED6.A Q3.3(D) R21.2
N$19: Q3.1(G) R22.2
N$20: LED6.C R23.1
N$21: R25.2 R26.1
N$22: R26.2 R27.1
N$23: LED7.A Q4.3(D) R27.2
N$24: Q4.1(G) R28.2
N$26: LED7.C R29.1
N$27: R31.2 R32.1
N$28: R32.2 R33.1
N$29: LED8.A Q5.3(D) R33.2
N$30: R56.2 U$2.JP2.6(D4)
N$31: Q5.1(G) R34.2
N$32: LED8.C R35.1
N$33: R37.2 R38.1
N$34: R38.2 R39.1
N$35: LED9.A Q6.3(D) R39.2
N$36: Q6.1(G) R40.2
N$37: LED9.C R41.1
N$38: R43.2 R44.1
N$39: R44.2 R45.1
N$40: LED11.A Q7.3(D) R45.2
N$41: Q7.1(G) R46.2
N$42: LED11.C R47.1
N$43: R49.2 R50.1
N$44: R50.2 R51.1
N$45: LED12.A Q8.3(D) R51.2
N$46: Q8.1(G) R52.2
N$47: LED12.C R63.1
N$48: R65.2 R66.1
N$49: R66.2 R67.1
N$50: LED13.A Q9.3(D) R67.2
N$51: Q9.1(G) R68.2
N$52: LED13.C R69.1
N$53: R71.2 R72.1
N$54: R72.2 R73.1
N$55: LED14.A Q10.3(D) R73.2
N$56: Q10.1(G) R74.2
N$57: LED14.C R75.1
N$58: R77.2 R78.1
N$59: R78.2 R79.1
N$60: LED15.A Q11.3(D) R79.2
N$61: Q11.1(G) R80.2
N$62: LED15.C R81.1
N$63: R84.2 R85.1
N$64: R85.2 R86.1
N$65: LED16.A Q12.3(D) R86.2
N$66: Q12.1(G) R87.2
N$67: LED16.C R88.1
N$68: R90.2 R91.1
N$69: R91.2 R92.1
N$70: R53.2 U$2.JP2.3(D1)
N$71: LED17.A Q13.3(D) R92.2
N$72: Q13.1(G) R93.2
N$73: R61.1 U$2.JP1.5(D6)
N$74: LED17.C R94.1
N$119: R62.1 U$2.JP1.6(D7)
N$120: R55.2 U$2.JP2.5(D3)
N$124: R54.2 U$2.JP2.4(D2)
N$145: LED34.A R177.1
N$146: LED35.A R178.1
N$147: LED36.A R179.1
N$148: LED33.A R180.1
N$149: R177.2 U$6.JP2.3(D1)
N$150: R180.2 U$6.JP2.6(D4)
N$151: R179.2 U$6.JP2.5(D3)
N$152: R178.2 U$6.JP2.4(D2)
N$153: R183.1 U$6.JP1.5(D6)
N$154: R184.1 U$6.JP1.6(D7)
N$155: JP21.2 U$6.JP1.1(RST)
N$156: JP21.1 U$6.JP1.3(D0)
N$157: R186.2 R187.1
N$158: R187.2 R188.1
N$159: LED37.A Q25.3(D) R188.2
N$160: Q25.1(G) R189.2
N$161: LED37.C R190.1
N$162: R192.2 R193.1
N$163: R193.2 R194.1
N$164: LED38.A Q26.3(D) R194.2
N$165: Q26.1(G) R195.2
N$166: LED38.C R196.1
N$167: R198.2 R199.1
N$168: R199.2 R200.1
N$169: LED39.A Q27.3(D) R200.2
N$170: Q27.1(G) R201.2
N$171: LED39.C R202.1
N$172: R204.2 R205.1
N$173: R205.2 R206.1
N$174: LED40.A Q28.3(D) R206.2
N$175: Q28.1(G) R207.2
N$176: LED40.C R208.1
N$177: R210.2 R211.1
N$178: R211.2 R212.1
N$179: LED41.A Q29.3(D) R212.2
N$180: Q29.1(G) R213.2
N$181: LED41.C R214.1
N$182: R216.2 R217.1
N$183: R217.2 R218.1
N$184: LED42.A Q30.3(D) R218.2
N$185: Q30.1(G) R219.2
N$186: LED42.C R220.1
N$187: R222.2 R223.1
N$188: R223.2 R224.1
N$189: LED43.A Q31.3(D) R224.2
N$190: Q31.1(G) R225.2
N$191: LED43.C R226.1
N$192: R228.2 R229.1
N$193: R229.2 R230.1
N$194: LED44.A Q32.3(D) R230.2
N$195: Q32.1(G) R231.2
N$196: LED44.C R232.1
N$197: R234.2 R235.1
N$198: R235.2 R236.1
N$199: LED45.A Q33.3(D) R236.2
N$200: Q33.1(G) R237.2
N$201: LED45.C R238.1
N$205: R240.2 R241.1
N$239: R241.2 R242.1
N$240: LED46.A Q34.3(D) R242.2
N$241: Q34.1(G) R243.2
N$242: LED46.C R244.1
N$243: R246.2 R247.1
N$244: R247.2 R248.1
N$245: LED47.A Q35.3(D) R248.2
N$246: Q35.1(G) R249.2
N$247: LED47.C R250.1
N$248: R252.2 R253.1
N$249: R253.2 R254.1
N$250: LED48.A Q36.3(D) R254.2
N$251: Q36.1(G) R255.2
N$252: LED48.C R256.1
P2: C7.2 C45.2 D3.1(K) D6.1(K) JP1.2 JP19.2 Q2.2(S) Q26.2(S) R12.2 R14.1 R23.2 R186.1 R190.2 R197.2
P3: C9.2 C47.2 JP1.3 JP19.3 Q3.2(S) Q25.2(S) R24.2 R31.1 R35.2 R191.2 R198.1 R202.2
P4: C8.2 C48.2 JP1.4 JP19.4 Q5.2(S) Q27.2(S) R25.1 R29.2 R36.2 R203.2 R204.1 R208.2
P5: C10.2 C49.2 JP1.5 JP19.5 Q4.2(S) Q28.2(S) R30.2 R37.1 R41.2 R209.2 R210.1 R214.2
P6: C11.2 C50.2 JP1.6 JP19.6 Q6.2(S) Q29.2(S) R42.2 R43.1 R47.2 R215.2 R216.1 R220.2
P7: C12.2 C51.2 JP1.7 JP19.7 Q7.2(S) Q30.2(S) R48.2 R49.1 R63.2 R221.2 R222.1 R226.2
P8: C13.2 C52.2 JP1.8 JP19.8 Q8.2(S) Q31.2(S) R64.2 R65.1 R69.2 R227.2 R228.1 R232.2
P9: C14.2 C53.2 JP1.9 JP19.9 Q9.2(S) Q32.2(S) R70.2 R71.1 R75.2 R233.2 R234.1 R238.2
P10: C15.2 C54.2 JP1.10 JP19.10 Q10.2(S) Q33.2(S) R76.2 R77.1 R81.2 R239.2 R240.1 R244.2
P11: C16.2 C55.2 JP1.11 JP19.11 Q11.2(S) Q34.2(S) R83.2 R84.1 R88.2 R245.2 R246.1 R250.2
P12: C17.2 C56.2 JP1.12 JP19.12 Q12.2(S) Q35.2(S) R89.2 R90.1 R94.2 R251.2 R252.1 R256.2
P13: D2.1(K) D5.1(K) JP1.13 JP19.13 Q13.2(S) Q36.2(S) R9.2 R15.2 R95.2 R175.2 R257.2 R258.2 U$1.IN+ U$5.IN+
S1: JP5.32 JP22.32 R10.1 R195.1
S2: JP5.36 JP22.36 R22.1 R189.1
S3: JP5.40 JP22.40 R34.1 R201.1
S4: JP5.37 JP22.37 R28.1 R207.1
S5: JP5.33 JP22.33 R40.1 R213.1
S6: JP5.29 JP22.29 R46.1 R219.1
S7: JP5.25 JP22.25 R52.1 R225.1
S8: JP5.21 JP22.21 R68.1 R231.1
S9: JP5.17 JP22.17 R74.1 R237.1
S10: JP5.13 JP22.13 R80.1 R243.1
S11: JP5.9 JP22.9 R87.1 R249.1
S12: JP5.5 JP22.5 R93.1 R255.1
SCK: JP5.6 JP22.6 U$2.JP1.4(D5) U$6.JP1.4(D5)
V+: C20.2 C60.2 JP5.1 JP22.1 R9.1 R258.1
VREF1: C1.+ C18.1 C41.+ C58.1 JP5.12 JP22.12
VREF2: C2.+ C4.1 C42.+ C57.1 JP2.1 JP2.3 JP5.14 JP20.1 JP20.3 JP22.14
VTEMP1: JP2.2 JP5.28 JP20.2 JP22.28 R57.2 R181.2
VTEMP2: JP2.4 JP5.26 JP20.4 JP22.26 R58.2 R182.2
Unconnected: U$2.JP2.1(TX) U$2.JP2.2(RX) U$6.JP2.1(TX) U$6.JP2.2(RX)

## Sheet 2 of 2

## Power pins joined to a net without a drawn wire
3V3: U$2.JP1.8(3V3) U$6.JP1.8(3V3)

## Library data of the parts
C1-C3 C41-C43 = rcl:CPOL-EU: POLARIZED CAPACITOR, European symbol
C4-C20 C44-C60 = rcl:C-EU: CAPACITOR, European symbol
D2 D3 D5 D6 = SamacSys_Parts:SM4007PL-TP: Rectifiers 1A, 1000V 1A, 1000V Source: Datasheet <http://www.mccsemi.com/up_pdf/SM4001PL-SM4007PL(SOD-123FL).PDF>; DESCRIPTION: Rectifiers 1A, 1000V 1A, 1000V; HEIGHT: 1.35mm; MANUFACTURER_NAME: Micro Commercial Components (MCC); MANUFACTURER_PART_NUMBER: SM4007PL-TP; MOUSER_PART_NUMBER: 833-SM4007PL-TP; MOUSER_PRICE-STOCK: https://www.mouser.co.uk/ProductDetail/Micro-Commercial-Components-MCC/SM4007PL-TP?qs=SdqRYZZ9IxCh9ylwm1K3UA%3D%3D
JP1 JP19 = pinhead:PINHD-1X13: PIN HEADER
JP2 JP20 = pinhead:PINHD-1X4: PIN HEADER
JP3 JP21 = pinhead_own:PINHD-1X2: PIN HEADER
JP4 JP6 JP26 JP27 = pinhead:PINHD-2X5: PIN HEADER
JP5 JP22 = pinhead:PINHD-2X20: PIN HEADER
JP9 JP23 = pinhead:PINHD-1X5: PIN HEADER
JP10 JP11 JP24 JP25 = pinhead:PINHD-1X2: PIN HEADER
LED1-LED9 LED11-LED17 LED33-LED48 = led:LED: LED OSRAM: - CHIPLED LG R971, LG N971, LY N971, LG Q971, LY Q971, LO R971, LY R971 LH N974, LH R974 LS Q976, LO Q976, LY Q976 LO Q996 - Hyper CHIPLED LW Q18S LB Q993, LB Q99A, LB R99A - SideLED LS A670, LO A670, LY A670, LG A670, LP A670 LB A673, LV A673, LT A673, LW A673 LH A674 LY A675 LS A676, LA A676, LO A676, LY A676, LW A676 LS A679, LY A679, LG A679 - Hyper Micro SIDELED® LS Y876, LA Y876, LO Y876, LY Y876 LT Y87S - SmartLED LW L88C, LW L88S LB L89C, LB L89S, LG L890 LS L89K, LO L89K, LY L89K LS L896, LA L896, LO L896, LY L896 - TOPLED LS T670, LO T670, LY T670, LG T670, LP T670 LSG T670, LSP T670, LSY T670, LOP T670, LYG T670 LG T671, LOG T671, LSG T671 LB T673, LV T673, LT T673, LW T673 LH T674 LS T676, LA T676, LO T676, LY T676, LB T676, LH T676, LSB T676, LW T676 LB T67C, LV T67C, LT T67C, LS T67K, LO T67K, LY T67K, LW E67C LS E67B, LA E67B, LO E67B, LY E67B, LB E67C, LV E67C, LT E67C LW T67C LS T679, LY T679, LG T679 LS T770, LO T770, LY T770, LG T770, LP T770 LB T773, LV T773, LT T773, LW T773 LH T774 LS E675, LA E675, LY E675, LS T675 LS T776, LA T776, LO T776, LY T776, LB T776 LHGB T686 LT T68C, LB T68C - Hyper Mini TOPLED® LB M676 - Mini TOPLED Santana® LG M470 LS M47K, LO M47K, LY M47K Source: http://www.osram.convergy.de LUXEON: - LUMILED® LXK2-PW12-R00, LXK2-PW12-S00, LXK2-PW14-U00, LXK2-PW14-V00 LXK2-PM12-R00, LXK2-PM12-S00, LXK2-PM14-U00 LXK2-PE12-Q00, LXK2-PE12-R00, LXK2-PE12-S00, LXK2-PE14-T00, LXK2-PE14-U00 LXK2-PB12-K00, LXK2-PB12-L00, LXK2-PB12-M00, LXK2-PB14-N00, LXK2-PB14-P00, LXK2-PB14-Q00 LXK2-PR12-L00, LXK2-PR12-M00, LXK2-PR14-Q00, LXK2-PR14-R00 LXK2-PD12-Q00, LXK2-PD12-R00, LXK2-PD12-S00 LXK2-PH12-R00, LXK2-PH12-S00 LXK2-PL12-P00, LXK2-PL12-Q00, LXK2-PL12-R00 Source: www.luxeon.com KINGBRIGHT: KA-3528ASYC Source: www.kingbright.com
Q2-Q13 Q25-Q36 = SamacSys_Parts:BSS84LT1G: MOSFET 50V 130mA P-Channel Source: Datasheet <http://www.onsemi.com/pub/Collateral/BSS84LT1-D.PDF>; DESCRIPTION: MOSFET 50V 130mA P-Channel; HEIGHT: 1.11mm; MANUFACTURER_NAME: ON Semiconductor; MANUFACTURER_PART_NUMBER: BSS84LT1G; MOUSER_PART_NUMBER: 863-BSS84LT1G; MOUSER_PRICE-STOCK: https://www.mouser.co.uk/ProductDetail/ON-Semiconductor/BSS84LT1G?qs=vNc2DXHODiKIGu9QIvMAfw%3D%3D
R1-R4 R7-R12 R14-R16 R20-R58 R61-R81 R83-R95 R173-R258 = rcl:R-EU_: RESISTOR, European symbol
U$1 U$5 = diy-modules:DC-DC-STEP-DOWN-LM2596HVS: DC/DC Step-Down Regulator based on LM2596-ADJ chip LM2596 datasheet available here: http://www.ti.com/lit/ds/symlink/lm2596.pdf Click here to find device on ebay.com <http://www.ebay.com/sch/lm2596+power+regulator>
U$2 U$6 = diy-modules:WEMOS-D1-MINI: WEMOS D1 mini: Mini Wi-Fi Board based on ESP-8266 device More details can be found here: https://www.wemos.cc/product/d1-mini.html Click here to find device on ebay.com <http://www.ebay.com/sch/wemos+d1+mini+nodemcu>